# Altium project XMOS_TSBOARD.PrjPCB
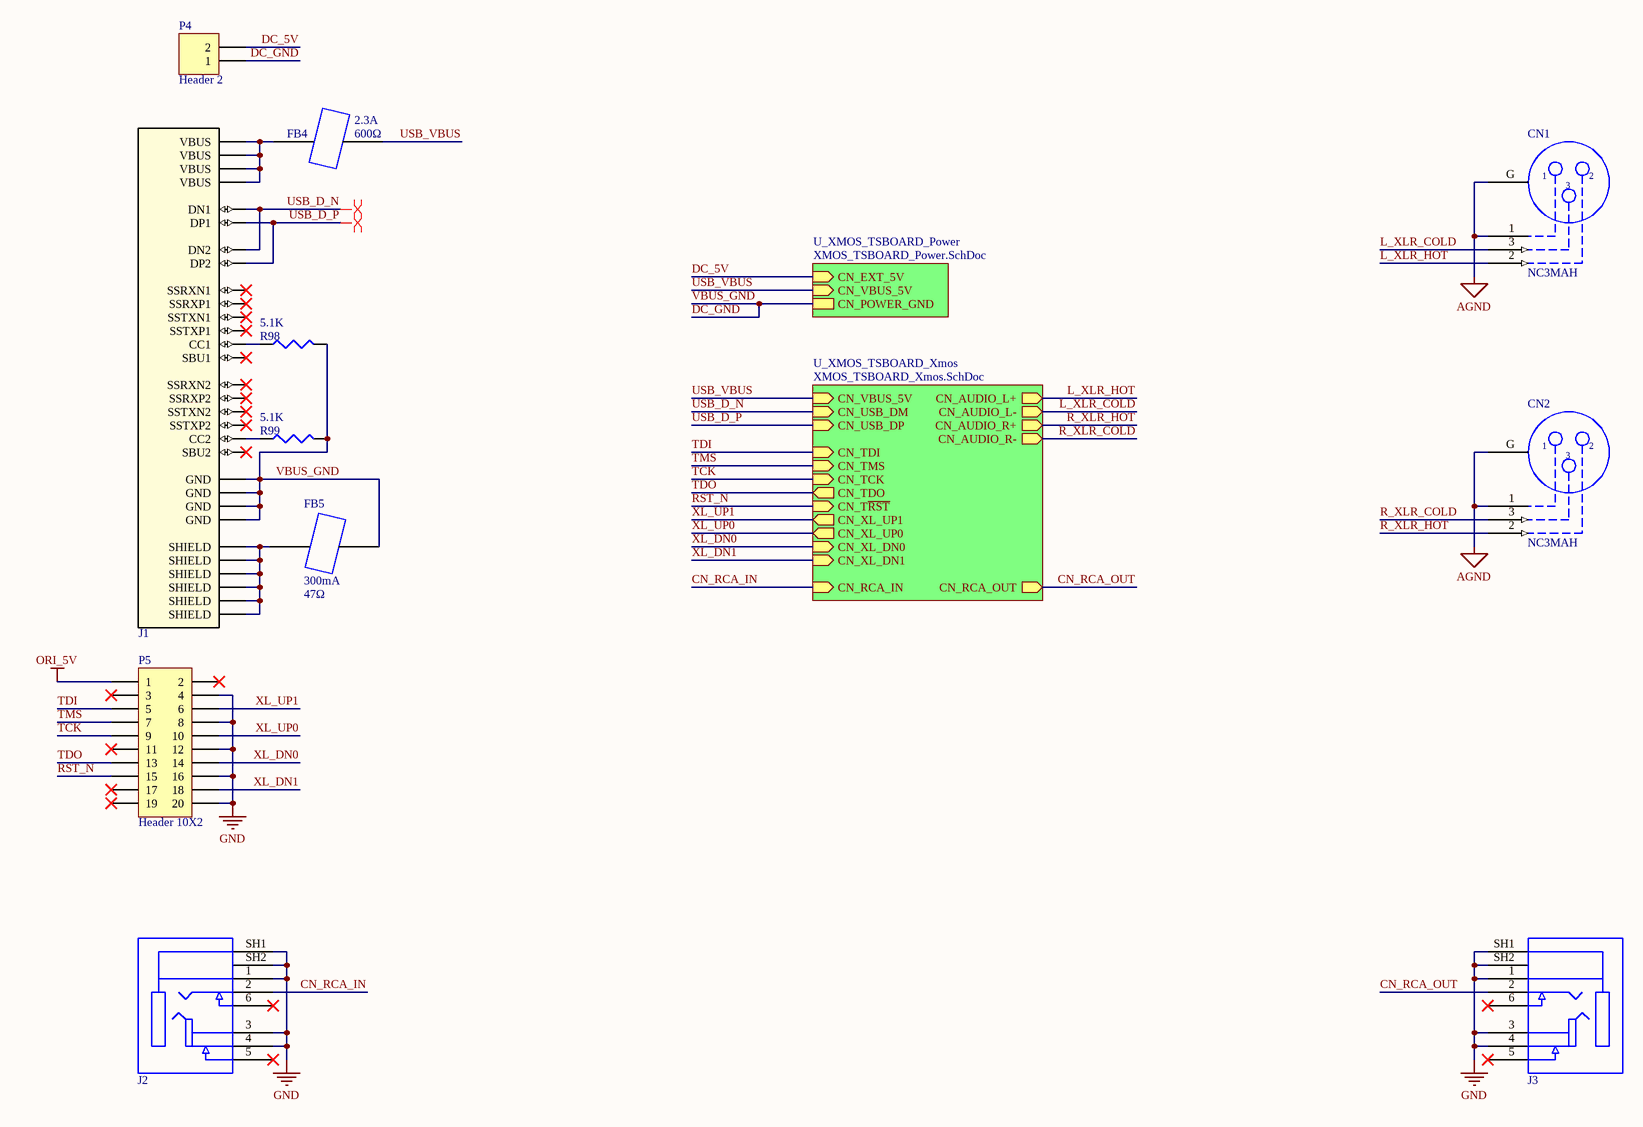
[diagram p0: XMOS_TSBOARD_Top.SchDoc]
8 sheets, 361 parts. Net scope: hierarchical (ports join the sheet entries above them; power ports are global).
Board file: XMOS_TSBOARD.PcbDoc
Sheets:
  XMOS_TSBOARD_Top.SchDoc
    U_XMOS_TSBOARD_Power = XMOS_TSBOARD_Power.SchDoc
    U_XMOS_TSBOARD_Xmos = XMOS_TSBOARD_Xmos.SchDoc
      U_XMOS_TSBOARD_PHY = XMOS_TSBOARD_PHY.SchDoc
      DACR = XMOS_TSBOARD_DAC.SchDoc
      LPFR = XMOS_TSBOARD_IV.SchDoc
      DACL = XMOS_TSBOARD_DAC.SchDoc
      LPFL = XMOS_TSBOARD_IV.SchDoc
      U_XMOS_TSBOARD_SPDIF = XMOS_TSBOARD_SPDIF.SchDoc
      U_XMOS_TSBOARD_Clock = XMOS_TSBOARD_Clock.SchDoc

## Sheet XMOS_TSBOARD_Top.SchDoc
size A3; DocumentNumber: 1; SheetNumber: 1; SheetTotal: 8

### Parts
CN1  NC3MAH  [NC3MAH]
CN2  NC3MAH  [NC3MAH]
FB4  RatedCurrent: 2.3A  Impedance(100MHz): 600Ω  [0805]  (hidden comment: FerriteBeads)
FB5  RatedCurrent: 300mA  Impedance(100MHz): 47Ω  [0603]  (hidden comment: FerriteBeads)
J1  UJ31-CH-G1-SMT-TR  [UJ31-CH-G1-SMT-TR]  (value not drawn)
J2  SJ-3506-SMT-TR  [SJ-3506-SMT-TR]  (value not drawn)
J3  SJ-3506-SMT-TR  [SJ-3506-SMT-TR]  (value not drawn)
P4  Header 2  [HDR1X2]
P5  Header 10X2  [HDR2X10]
R98  value 5.1K  [J1-0603]  (hidden comment: Res3)
R99  value 5.1K  [J1-0603]  (hidden comment: Res3)

### Sub-sheets
U_XMOS_TSBOARD_Power = XMOS_TSBOARD_Power.SchDoc: CN_EXT_5V (in), CN_VBUS_5V (in), CN_POWER_GND
U_XMOS_TSBOARD_Xmos = XMOS_TSBOARD_Xmos.SchDoc: CN_USB_DP (in), CN_USB_DM (in), CN_VBUS_5V (in), CN_TDO (out), CN_TDI (in), CN_TCK (in), CN_TMS (in), CN_T~{RST} (in), CN_AUDIO_L+ (out), CN_AUDIO_L- (out), CN_AUDIO_R+ (out), CN_AUDIO_R- (out), CN_RCA_IN (in), CN_RCA_OUT (out), CN_XL_DN0 (in), CN_XL_DN1 (in), CN_XL_UP0 (out), CN_XL_UP1 (out)

### Nets
AGND: CN1.1 CN1.G CN2.1 CN2.G
GND: J2.1(SLEEVE) J2.3(RING) J2.4(ISOLATED_RING) J2.SH1(SHIELDING) J2.SH2(SHIELDING) J3.1(SLEEVE) J3.3(RING) J3.4(ISOLATED_RING) J3.SH1(SHIELDING) J3.SH2(SHIELDING) P5.4 P5.8 P5.12 P5.16 P5.20
ORI_5V: P5.1
CN_RCA_IN: J2.2(TIP) ; sheet U_XMOS_TSBOARD_Xmos/CN_RCA_IN
CN_RCA_OUT: J3.2(TIP) ; sheet U_XMOS_TSBOARD_Xmos/CN_RCA_OUT
DC_5V: P4.2 ; sheet U_XMOS_TSBOARD_Power/CN_EXT_5V
DC_GND: FB5.1 J1.A1(GND) J1.A12(GND) J1.B1(GND) J1.B12(GND) P4.1 R98.2 R99.2 ; sheet U_XMOS_TSBOARD_Power/CN_POWER_GND  [also labelled VBUS_GND]
L_XLR_COLD: CN1.3 ; sheet U_XMOS_TSBOARD_Xmos/CN_AUDIO_L-
L_XLR_HOT: CN1.2 ; sheet U_XMOS_TSBOARD_Xmos/CN_AUDIO_L+
R_XLR_COLD: CN2.3 ; sheet U_XMOS_TSBOARD_Xmos/CN_AUDIO_R-  [project net OUT1]
R_XLR_HOT: CN2.2 ; sheet U_XMOS_TSBOARD_Xmos/CN_AUDIO_R+  [project net OUT0]
RST_N: P5.15 ; sheet U_XMOS_TSBOARD_Xmos/CN_T~{RST}
TCK: P5.9 ; sheet U_XMOS_TSBOARD_Xmos/CN_TCK
TDI: P5.5 ; sheet U_XMOS_TSBOARD_Xmos/CN_TDI
TDO: P5.13 ; sheet U_XMOS_TSBOARD_Xmos/CN_TDO
TMS: P5.7 ; sheet U_XMOS_TSBOARD_Xmos/CN_TMS
USB_D_N: J1.A7(DN1) J1.B7(DN2) ; sheet U_XMOS_TSBOARD_Xmos/CN_USB_DM
USB_D_P: J1.A6(DP1) J1.B6(DP2) ; sheet U_XMOS_TSBOARD_Xmos/CN_USB_DP
USB_VBUS: FB4.1 ; sheet U_XMOS_TSBOARD_Power/CN_VBUS_5V, sheet U_XMOS_TSBOARD_Xmos/CN_VBUS_5V
XL_DN0: P5.14 ; sheet U_XMOS_TSBOARD_Xmos/CN_XL_DN0
XL_DN1: P5.18 ; sheet U_XMOS_TSBOARD_Xmos/CN_XL_DN1
XL_UP0: P5.10 ; sheet U_XMOS_TSBOARD_Xmos/CN_XL_UP0
XL_UP1: P5.6 ; sheet U_XMOS_TSBOARD_Xmos/CN_XL_UP1
NetFB4_2: FB4.2 J1.A4(VBUS) J1.A9(VBUS) J1.B4(VBUS) J1.B9(VBUS)
NetFB5_2: FB5.2 J1.SH1(SHIELD) J1.SH2(SHIELD) J1.SH3(SHIELD) J1.SH4(SHIELD) J1.SH5(SHIELD) J1.SH6(SHIELD)
NetJ1_A5: J1.A5(CC1) R98.1
NetJ1_B5: J1.B5(CC2) R99.1

Not connected (* = marked no-connect by the designer): J1 A2(SSTXP1)* A3(SSTXN1)* A8(SBU1)* A10(SSRXN2)* A11(SSRXP2)* B2(SSTXP2)* B3(SSTXN2)* B8(SBU2)* B10(SSRXN1)* B11(SSRXP1)*; J2 5(ISOLATED_RING_SWITCH(N-O))* 6(TIP_SWITCH)*; J3 5(ISOLATED_RING_SWITCH(N-O))* 6(TIP_SWITCH)*; P5 2* 3* 11* 17* 19*

### Layout directives
differential pair: USB_D_N, USB_D_P

### Library data of the parts
CN1 CN2 = NC3MAH: 3 pole male XLR receptacle
FB4 = FerriteBeads: Chip Ferrite Beads; DCResistance: 0.06Ω; ManID: BLM21SP601
FB5 = FerriteBeads: Chip Ferrite Beads; DCResistance: 0.55Ω; ManID: BLM18BA470
J1 = UJ31-CH-G1-SMT-TR: USB Type C receptacle
J2 J3 = SJ-3506-SMT-TR: Mid Mount Audio Jack
P4 = Header 2: Header, 2-Pin; LatestRevisionDate: 17-Jul-2002; LatestRevisionNote: Re-released for DXP Platform.; Publisher: Altium Limited
P5 = Header 10X2: Header, 10-Pin, Dual row; LatestRevisionDate: 17-Jul-2002; LatestRevisionNote: Re-released for DXP Platform.; Publisher: Altium Limited
R98 R99 = Res3: Resistor; Published: 8-Jun-2000; LatestRevisionDate: 29-May-2009; LatestRevisionNote: IPC-7351 Footprint Added.; PackageReference: J1-0603; Publisher: Altium Limited; PackageDescription: Chip Resistor

## Sheet XMOS_TSBOARD_Power.SchDoc
size A3; DocumentNumber: 2; SheetNumber: 2; SheetTotal: 8
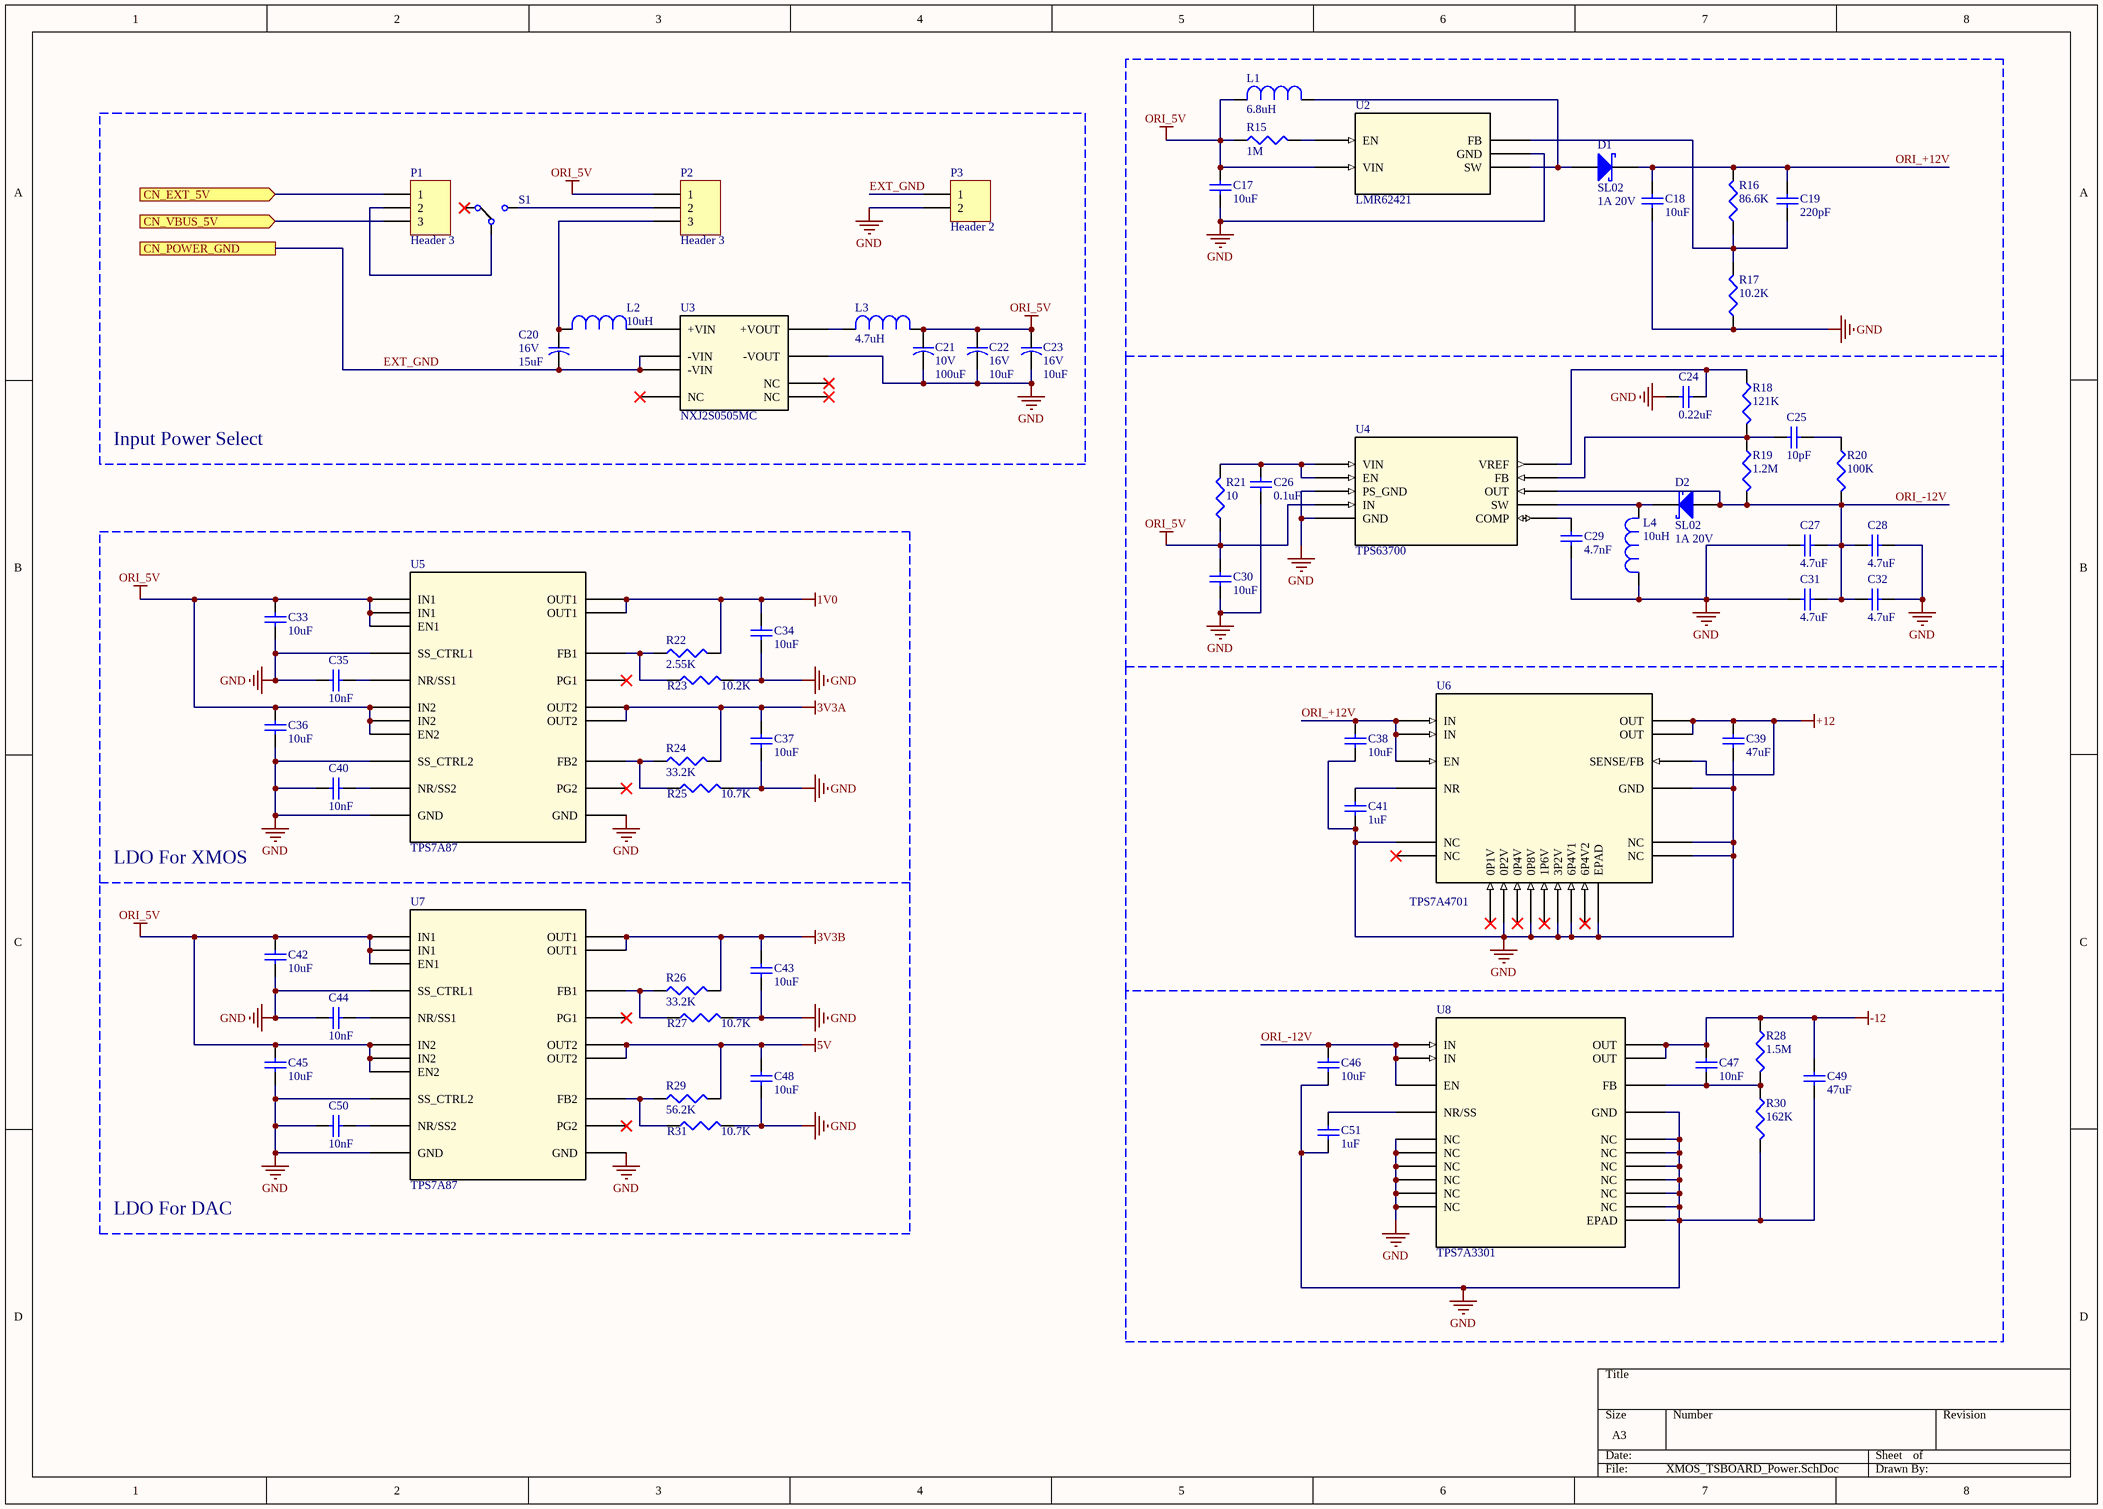
[diagram p1: XMOS_TSBOARD_Power.SchDoc]

### Parts
C17  value 10uF  [1608[0603]]  (hidden comment: Cap Semi)
C18  value 10uF  [C0805]  (hidden comment: Cap Semi)
C19  value 220pF  [1608[0603]]  (hidden comment: Cap Semi)
C20  value 15uF  RatedVoltage: 16V  [3528-21]  (hidden comment: KO-CAP)
C21  value 100uF  RatedVoltage: 10V  [3528-21]  (hidden comment: KO-CAP)
C22  value 10uF  RatedVoltage: 16V  [3528-21]  (hidden comment: KO-CAP)
C23  value 10uF  RatedVoltage: 16V  [3528-21]  (hidden comment: KO-CAP)
C24  value 0.22uF  [1608[0603]]  (hidden comment: Cap Semi)
C25  value 10pF  [1608[0603]]  (hidden comment: Cap Semi)
C26  value 0.1uF  [1608[0603]]  (hidden comment: Cap Semi)
C27  value 4.7uF  [C0805]  (hidden comment: Cap Semi)
C28  value 4.7uF  [C0805]  (hidden comment: Cap Semi)
C29  value 4.7nF  [1608[0603]]  (hidden comment: Cap Semi)
C30  value 10uF  [1608[0603]]  (hidden comment: Cap Semi)
C31  value 4.7uF  [C0805]  (hidden comment: Cap Semi)
C32  value 4.7uF  [C0805]  (hidden comment: Cap Semi)
C33  value 10uF  [1608[0603]]  (hidden comment: Cap Semi)
C34  value 10uF  [1608[0603]]  (hidden comment: Cap Semi)
C35  value 10nF  [1608[0603]]  (hidden comment: Cap Semi)
C36  value 10uF  [1608[0603]]  (hidden comment: Cap Semi)
C37  value 10uF  [1608[0603]]  (hidden comment: Cap Semi)
C38  value 10uF  [C0805]  (hidden comment: Cap Semi)
C39  value 47uF  [C1210]  (hidden comment: Cap Semi)
C40  value 10nF  [1608[0603]]  (hidden comment: Cap Semi)
C41  value 1uF  [1608[0603]]  (hidden comment: Cap Semi)
C42  value 10uF  [1608[0603]]  (hidden comment: Cap Semi)
C43  value 10uF  [1608[0603]]  (hidden comment: Cap Semi)
C44  value 10nF  [1608[0603]]  (hidden comment: Cap Semi)
C45  value 10uF  [1608[0603]]  (hidden comment: Cap Semi)
C46  value 10uF  [C0805]  (hidden comment: Cap Semi)
C47  value 10nF  [1608[0603]]  (hidden comment: Cap Semi)
C48  value 10uF  [1608[0603]]  (hidden comment: Cap Semi)
C49  value 47uF  [C1210]  (hidden comment: Cap Semi)
C50  value 10nF  [1608[0603]]  (hidden comment: Cap Semi)
C51  value 1uF  [1608[0603]]  (hidden comment: Cap Semi)
D1  SL02  value 1A 20V  [DO-219AB]
D2  SL02  value 1A 20V  [DO-219AB]
L1  value 6.8uH  [4240]  (hidden comment: SPM)
L2  value 10uH  [5250]  (hidden comment: SPM)
L3  value 4.7uH  [4240]  (hidden comment: SPM)
L4  value 10uH  [4240]  (hidden comment: SPM)
P1  Header 3  [HDR1X3]
P2  Header 3  [HDR1X3]
P3  Header 2  [HDR1X2]
R15  value 1M  [J1-0603]  (hidden comment: Res3)
R16  value 86.6K  [J1-0603]  (hidden comment: Res3)
R17  value 10.2K  [J1-0603]  (hidden comment: Res3)
R18  value 121K  [J1-0603]  (hidden comment: Res3)
R19  value 1.2M  [J1-0603]  (hidden comment: Res3)
R20  value 100K  [J1-0603]  (hidden comment: Res3)
R21  value 10  [J1-0603]  (hidden comment: Res3)
R22  value 2.55K  [J1-0603]  (hidden comment: Res3)
R23  value 10.2K  [J1-0603]  (hidden comment: Res3)
R24  value 33.2K  [J1-0603]  (hidden comment: Res3)
R25  value 10.7K  [J1-0603]  (hidden comment: Res3)
R26  value 33.2K  [J1-0603]  (hidden comment: Res3)
R27  value 10.7K  [J1-0603]  (hidden comment: Res3)
R28  value 1.5M  [J1-0603]  (hidden comment: Res3)
R29  value 56.2K  [J1-0603]  (hidden comment: Res3)
R30  value 162K  [J1-0603]  (hidden comment: Res3)
R31  value 10.7K  [J1-0603]  (hidden comment: Res3)
S1  SSSS213202  [SS_SMD_213202]  (value not drawn)
U2  LMR62421  [DBV5]
U3  NXJ2S0505MC  [SMD_NXJ2S0505]
U4  TPS63700  [DRC10]
U5  TPS7A87  [RTJ20]
U6  TPS7A4701  [RGW20]
U7  TPS7A87  [RTJ20]
U8  TPS7A3301  [RGW20]

### Blocks framed on the sheet
Input Power Select: C20-C23 L2 L3 P1-P3 S1 U3
LDO For XMOS: C33-C37 C40 R22-R25 U5
LDO For DAC: C42-C45 C48 C50 R26 R27 R29 R31 U7

### Ports
CN_EXT_5V (in), CN_POWER_GND, CN_VBUS_5V (in)

### Nets
1V0: C34.2 R22.2 U5.14(OUT1) U5.15(OUT1)
3V3A: C37.2 R24.2 U5.11(OUT2) U5.12(OUT2)
3V3B: C43.2 R26.2 U7.14(OUT1) U7.15(OUT1)
5V: C48.2 R29.2 U7.11(OUT2) U7.12(OUT2)
+12: C39.2 U6.1(OUT) U6.3(SENSE/FB) U6.20(OUT)
-12: C47.1 C49.2 R28.1 U8.1(OUT) U8.20(OUT)
GND: C17.1 C18.1 C21.2 C22.2 C23.2 C24.2 C26.1 C27.2 C28.1 C29.2 C30.1 C31.2 C32.1 C33.1 C34.1 C35.1 C36.1 C37.1 C38.1 C39.1 C40.1 C41.1 C42.1 C43.1 C44.1 C45.1 C46.1 C48.1 C49.1 C50.1 C51.1 L4.2 P3.2 R17.1 R23.2 R25.2 R27.2 R30.2 R31.2 U2.2(GND) U3.5(-VOUT) U4.2(GND) U4.7(PS_GND) U5.3(GND) U5.8(SS_CTRL2) U5.13(GND) U5.18(SS_CTRL1) U6.5(6P4V1) U6.6(3P2V) U6.7(GND) U6.9(0P8V) U6.11(0P2V) U6.17(NC) U6.18(NC) U6.19(NC) U6.21(EPAD) U7.3(GND) U7.8(SS_CTRL2) U7.13(GND) U7.18(SS_CTRL1) U8.2(NC) U8.4(NC) U8.5(NC) U8.6(NC) U8.7(GND) U8.8(NC) U8.9(NC) U8.10(NC) U8.11(NC) U8.12(NC) U8.17(NC) U8.18(NC) U8.19(NC) U8.21(EPAD)
ORI_5V: C17.2 C21.1 C22.1 C23.1 C30.2 C33.2 C36.2 C42.2 C45.2 L1.2 L3.1 P2.1 R15.1 R21.1 U2.5(VIN) U4.5(IN) U5.1(IN1) U5.2(IN1) U5.4(IN2) U5.5(IN2) U5.6(EN2) U5.20(EN1) U7.1(IN1) U7.2(IN1) U7.4(IN2) U7.5(IN2) U7.6(EN2) U7.20(EN1)
DC_5V: P1.1 ; port CN_EXT_5V
EXT_GND: C20.2 P3.1 U3.2(-VIN) U3.11(-VIN) ; port CN_POWER_GND  [project net DC_GND]
ORI_+12V: C18.2 C19.2 C38.2 D1.2 R16.2 U6.13(EN) U6.15(IN) U6.16(IN)
ORI_-12V: C27.1 C28.2 C31.1 C32.2 C46.2 D2.1 R19.2 R20.2 U4.8(OUT) U8.13(EN) U8.15(IN) U8.16(IN)
USB_VBUS: P1.3 ; port CN_VBUS_5V
NetC19_1: C19.1 R16.1 R17.2 U2.3(FB)
NetC20_1: C20.1 L2.2 P2.3
NetC24_1: C24.1 R18.1 U4.10(VREF)
NetC25_1: C25.1 R20.1
NetC25_2: C25.2 R18.2 R19.1 U4.9(FB)
NetC26_2: C26.2 R21.2 U4.3(VIN) U4.4(EN)
NetC29_1: C29.1 U4.1(COMP)
NetC35_2: C35.2 U5.19(NR/SS1)
NetC40_2: C40.2 U5.7(NR/SS2)
NetC41_2: C41.2 U6.14(NR)
NetC44_2: C44.2 U7.19(NR/SS1)
NetC47_2: C47.2 R28.2 R30.1 U8.3(FB)
NetC50_2: C50.2 U7.7(NR/SS2)
NetC51_2: C51.2 U8.14(NR/SS)
NetD1_1: D1.1 L1.1 U2.1(SW)
NetD2_2: D2.2 L4.1 U4.6(SW)
NetL2_1: L2.1 U3.1(+VIN)
NetL3_2: L3.2 U3.6(+VOUT)
NetP1_2: P1.2 S1.2(COM)
NetP2_2: P2.2 S1.3
NetR15_2: R15.2 U2.4(EN)
NetR22_1: R22.1 R23.1 U5.16(FB1)
NetR24_1: R24.1 R25.1 U5.10(FB2)
NetR26_1: R26.1 R27.1 U7.16(FB1)
NetR29_1: R29.1 R31.1 U7.10(FB2)

Not connected (* = marked no-connect by the designer): S1 1*; U3 7(NC)* 8(NC)* 12(NC)*; U5 9(PG2)* 17(PG1)*; U6 2(NC)* 4(6P4V2)* 8(1P6V)* 10(0P4V)* 12(0P1V)*; U7 9(PG2)* 17(PG1)*

### Library data of the parts
C17-C19 C24-C51 = Cap Semi: Capacitor (Semiconductor SIM Model); Published: 8-Jun-2000; LatestRevisionDate: 29-May-2009; LatestRevisionNote: IPC-7351 Footprint Added.; PackageReference: C1206; Publisher: Altium Limited; PackageDescription: Chip Capacitor
C20-C23 = T520B: Polymer Electrolytic Capacitors
D1 D2 = SL02: Schottky Rectifier
L1 = SPM: Inductors for power circuits, wound metal, SPM series; ManCode: SPM5030-HZ
L2 L3 = SPM: Inductors for power circuits, wound metal, SPM series
L4 = SPM: Inductors for power circuits, wound metal, SPM series; List: SPM5030-HZ
P1 P2 = Header 3: Header, 3-Pin; LatestRevisionDate: 17-Jul-2002; LatestRevisionNote: Re-released for DXP Platform.; Publisher: Altium Limited
P3 = Header 2: Header, 2-Pin; LatestRevisionDate: 17-Jul-2002; LatestRevisionNote: Re-released for DXP Platform.; Publisher: Altium Limited
R15-R31 = Res3: Resistor; Published: 8-Jun-2000; LatestRevisionDate: 29-May-2009; LatestRevisionNote: IPC-7351 Footprint Added.; PackageReference: J1-0603; Publisher: Altium Limited; PackageDescription: Chip Resistor
S1 = SSSS213202: Slide Switch 3.5(H)mm, 2.0mm-travel Type SSSS2 Series
U2 = LMR62421: LMR62421 SIMPLE SWITCHER® 24Vout, 2.1A Step-Up Voltage Regulator in SOT-23
U3 = NXJ2S0505MC: Isolated 2W Single Output SM DC-DC Converters
U4 = TPS63700: DC-DC Inverter
U5 U7 = TPS7A87: Dual, 500-mA, Low-Noise (3.8 μVRMS), LDO Voltage Regulator
U6 = TPS7A4701: TPS7A470x 36-V, 1-A, 4-µVRMS, RF LDO Voltage Regulator
U8 = TPS7A3301: TPS7A33 –36-V, 1-A, Ultralow-Noise Negative Voltage Regulator

## Sheet XMOS_TSBOARD_Xmos.SchDoc
size A3; DocumentNumber: 3; SheetNumber: 3; SheetTotal: 8
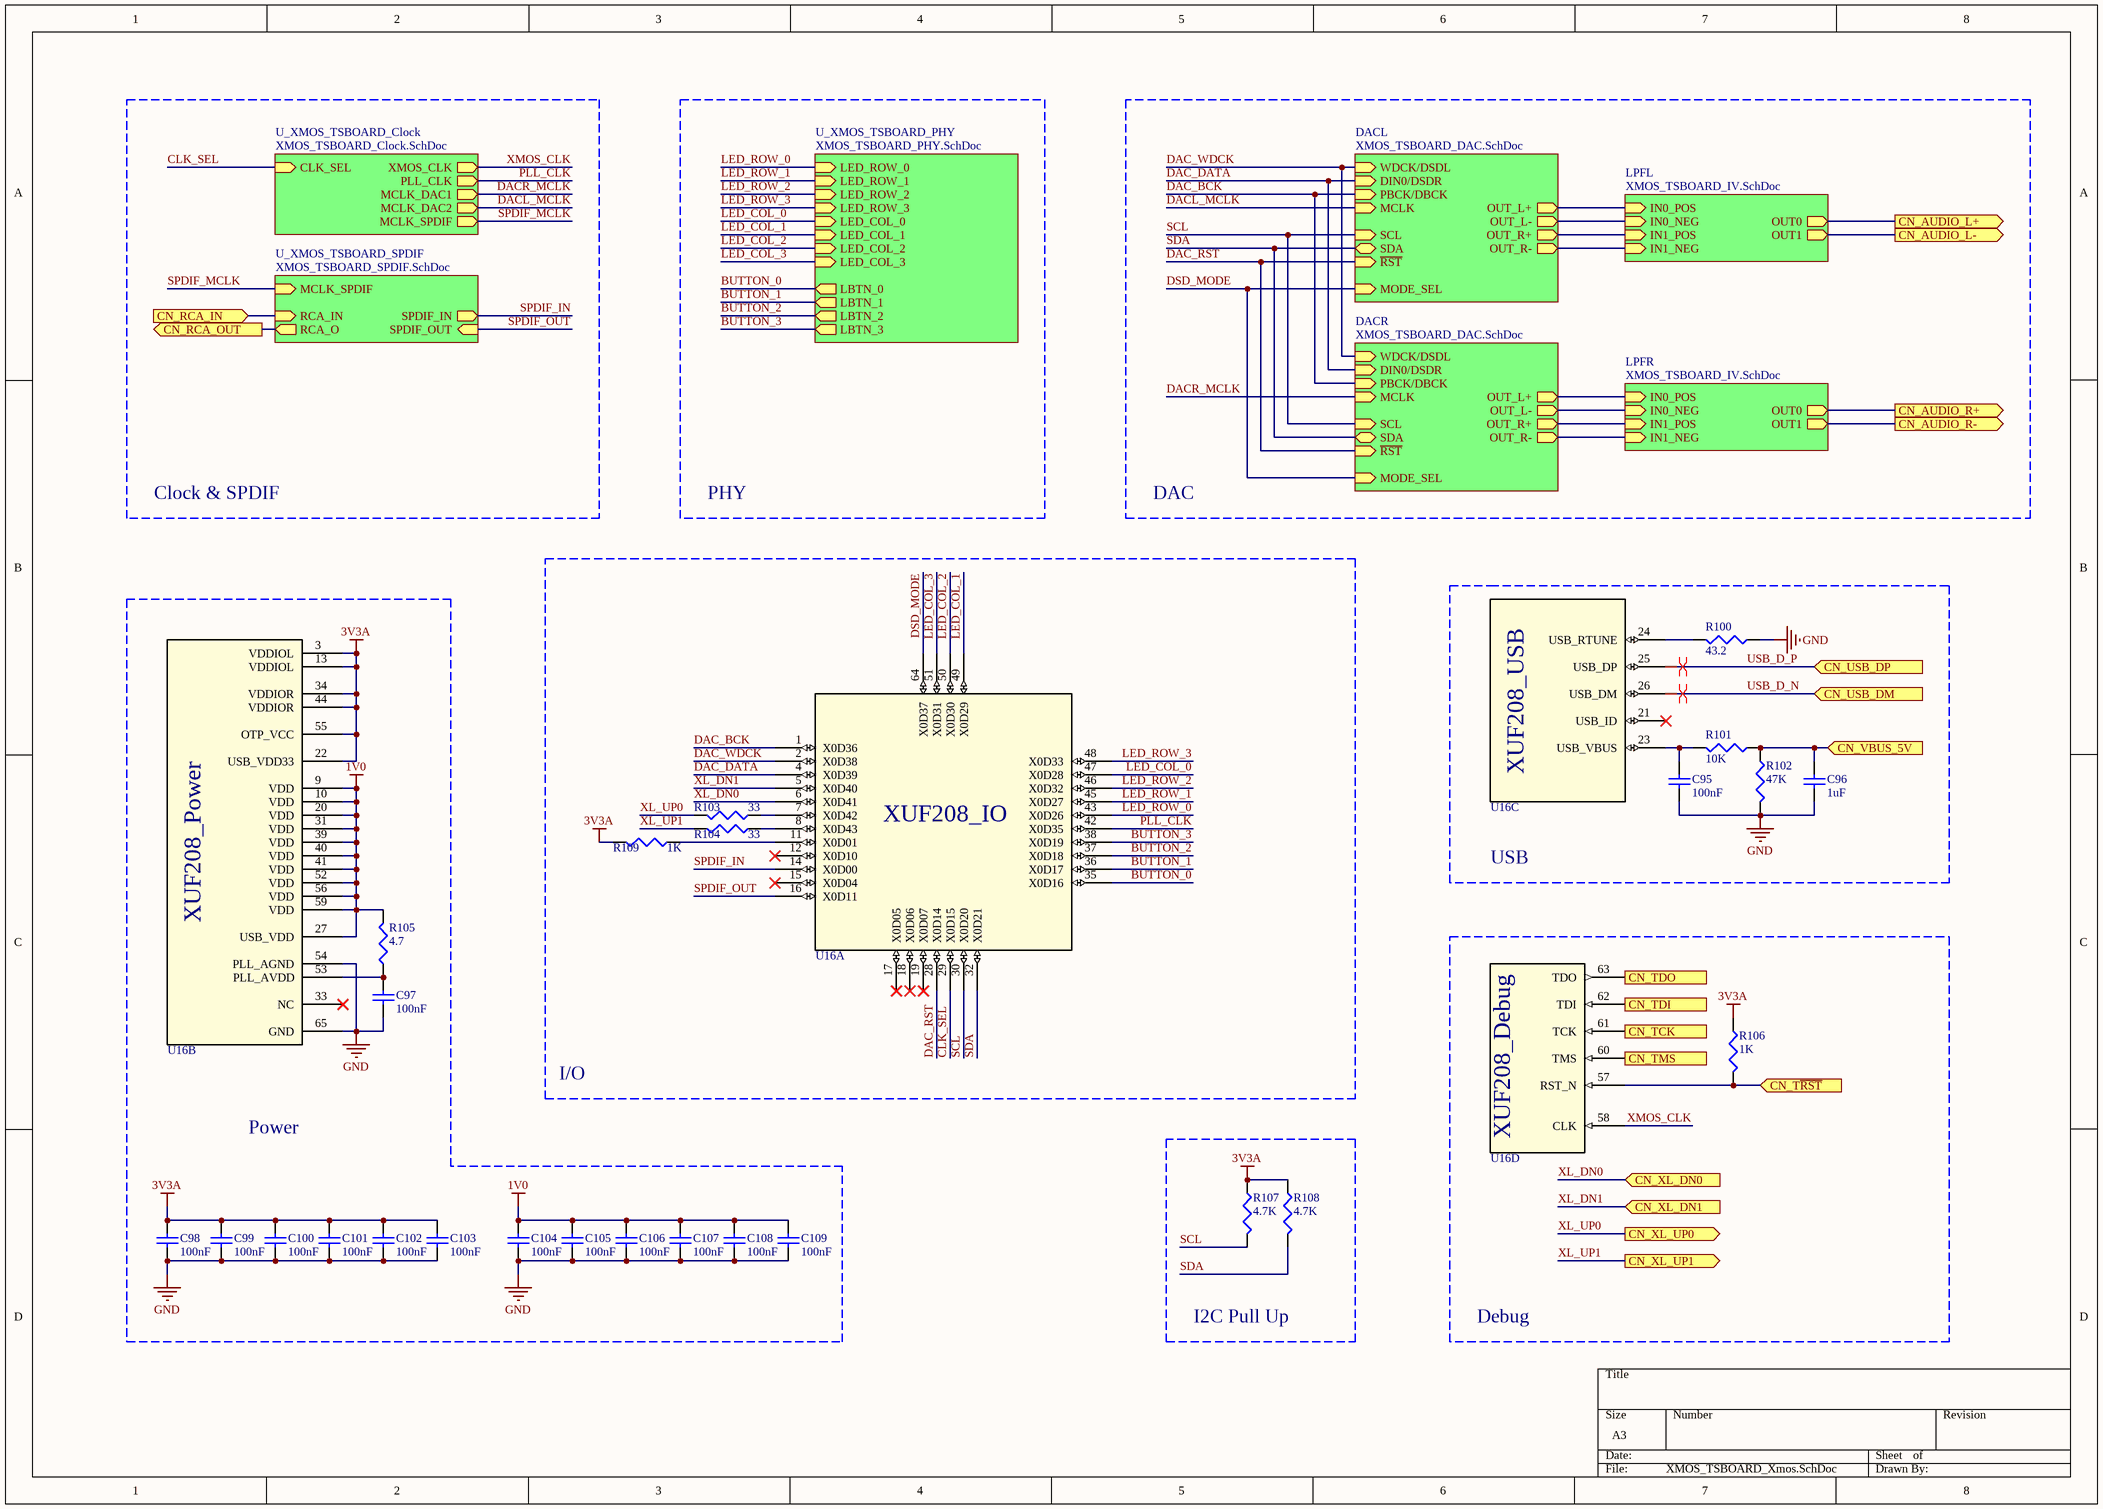
[diagram p2: XMOS_TSBOARD_Xmos.SchDoc]

### Parts
C95  value 100nF  [1608[0603]]  (hidden comment: Cap Semi)
C96  value 1uF  [1608[0603]]  (hidden comment: Cap Semi)
C97  value 100nF  [1608[0603]]  (hidden comment: Cap Semi)
C98  value 100nF  [1608[0603]]  (hidden comment: Cap Semi)
C99  value 100nF  [1608[0603]]  (hidden comment: Cap Semi)
C100  value 100nF  [1608[0603]]  (hidden comment: Cap Semi)
C101  value 100nF  [1608[0603]]  (hidden comment: Cap Semi)
C102  value 100nF  [1608[0603]]  (hidden comment: Cap Semi)
C103  value 100nF  [1608[0603]]  (hidden comment: Cap Semi)
C104  value 100nF  [1608[0603]]  (hidden comment: Cap Semi)
C105  value 100nF  [1608[0603]]  (hidden comment: Cap Semi)
C106  value 100nF  [1608[0603]]  (hidden comment: Cap Semi)
C107  value 100nF  [1608[0603]]  (hidden comment: Cap Semi)
C108  value 100nF  [1608[0603]]  (hidden comment: Cap Semi)
C109  value 100nF  [1608[0603]]  (hidden comment: Cap Semi)
R100  value 43.2  [J1-0603]  (hidden comment: Res3)
R101  value 10K  [J1-0603]  (hidden comment: Res3)
R102  value 47K  [J1-0603]  (hidden comment: Res3)
R103  value 33  [J1-0603]  (hidden comment: Res3)
R104  value 33  [J1-0603]  (hidden comment: Res3)
R105  value 4.7  [J1-0603]  (hidden comment: Res3)
R106  value 1K  [J1-0603]  (hidden comment: Res3)
R107  value 4.7K  [J1-0603]  (hidden comment: Res3)
R108  value 4.7K  [J1-0603]  (hidden comment: Res3)
R109  value 1K  [J1-0603]  (hidden comment: Res3)
U16  XUF208-256-TQ64  [TQFP64]  (value not drawn)  (parts A,B,C,D of 4)

### Blocks framed on the sheet
I/O: R103 R104 R109 U16
Power: C97-C109 R105 U16
USB: C95 C96 R100-R102 U16
Debug: R106 U16
I2C Pull Up: R107 R108

### Sub-sheets
DACL = XMOS_TSBOARD_DAC.SchDoc: MODE_SEL (in), MCLK (in), SCL (in), SDA (bidir), ~{RST} (in), WDCK/DSDL (in), PBCK/DBCK (in), DIN0/DSDR (in), OUT_L- (out), OUT_L+ (out), OUT_R- (out), OUT_R+ (out)
DACR = XMOS_TSBOARD_DAC.SchDoc: MODE_SEL (in), MCLK (in), SCL (in), SDA (bidir), ~{RST} (in), WDCK/DSDL (in), PBCK/DBCK (in), DIN0/DSDR (in), OUT_L- (out), OUT_L+ (out), OUT_R- (out), OUT_R+ (out)
LPFL = XMOS_TSBOARD_IV.SchDoc: IN0_POS (in), IN0_NEG (in), IN1_POS (in), IN1_NEG (in), OUT0 (out), OUT1 (out)
LPFR = XMOS_TSBOARD_IV.SchDoc: IN0_POS (in), IN0_NEG (in), IN1_POS (in), IN1_NEG (in), OUT0 (out), OUT1 (out)
U_XMOS_TSBOARD_Clock = XMOS_TSBOARD_Clock.SchDoc: CLK_SEL (in), XMOS_CLK (out), PLL_CLK (out), MCLK_DAC1 (out), MCLK_DAC2 (out), MCLK_SPDIF (out)
U_XMOS_TSBOARD_PHY = XMOS_TSBOARD_PHY.SchDoc: LED_ROW_0 (in), LED_ROW_1 (in), LED_ROW_2 (in), LED_ROW_3 (in), LED_COL_0 (in), LED_COL_1 (in), LED_COL_2 (in), LED_COL_3 (in), LBTN_0 (out), LBTN_1 (out), LBTN_2 (out), LBTN_3 (out)
U_XMOS_TSBOARD_SPDIF = XMOS_TSBOARD_SPDIF.SchDoc: SPDIF_OUT (in), MCLK_SPDIF (in), RCA_IN (in), RCA_O (out), SPDIF_IN (out)

### Ports
CN_AUDIO_L+ (out), CN_AUDIO_L- (out), CN_AUDIO_R+ (out), CN_AUDIO_R- (out), CN_RCA_IN (in), CN_RCA_OUT (out), CN_TCK (in), CN_TDI (in), CN_TDO (out), CN_TMS (in), CN_T~{RST} (in), CN_USB_DM (in), CN_USB_DP (in), CN_VBUS_5V (in), CN_XL_DN0 (in), CN_XL_DN1 (in), CN_XL_UP0 (out), CN_XL_UP1 (out)

### Nets
1V0: C104.2 C105.2 C106.2 C107.2 C108.2 C109.2 R105.2 U16.9(VDD) U16.10(VDD) U16.20(VDD) U16.27(USB_VDD) U16.31(VDD) U16.39(VDD) U16.40(VDD) U16.41(VDD) U16.52(VDD) U16.56(VDD) U16.59(VDD)
3V3A: C98.2 C99.2 C100.2 C101.2 C102.2 C103.2 R106.1 R107.1 R108.1 R109.2 U16.3(VDDIOL) U16.13(VDDIOL) U16.22(USB_VDD33) U16.34(VDDIOR) U16.44(VDDIOR) U16.55(OTP_VCC)
GND: C95.1 C96.1 C97.1 C98.1 C99.1 C100.1 C101.1 C102.1 C103.1 C104.1 C105.1 C106.1 C107.1 C108.1 C109.1 R100.1 R102.2 U16.54(PLL_AGND) U16.65(GND)
BUTTON_0: U16.35(X0D16) ; sheet U_XMOS_TSBOARD_PHY/LBTN_0
BUTTON_1: U16.36(X0D17) ; sheet U_XMOS_TSBOARD_PHY/LBTN_1
BUTTON_2: U16.37(X0D18) ; sheet U_XMOS_TSBOARD_PHY/LBTN_2
BUTTON_3: U16.38(X0D19) ; sheet U_XMOS_TSBOARD_PHY/LBTN_3
CLK_SEL: U16.29(X0D15) ; sheet U_XMOS_TSBOARD_Clock/CLK_SEL
CN_RCA_IN: port CN_RCA_IN, sheet U_XMOS_TSBOARD_SPDIF/RCA_IN
CN_RCA_OUT: port CN_RCA_OUT, sheet U_XMOS_TSBOARD_SPDIF/RCA_O
DAC_BCK: U16.1(X0D36) ; sheet DACR/PBCK/DBCK, sheet DACL/PBCK/DBCK
DAC_DATA: U16.4(X0D39) ; sheet DACR/DIN0/DSDR, sheet DACL/DIN0/DSDR
DAC_RST: U16.28(X0D14) ; sheet DACR/~{RST}, sheet DACL/~{RST}
DAC_WDCK: U16.2(X0D38) ; sheet DACR/WDCK/DSDL, sheet DACL/WDCK/DSDL
DACL_MCLK: sheet DACL/MCLK, sheet U_XMOS_TSBOARD_Clock/MCLK_DAC2
DACR_MCLK: sheet DACR/MCLK, sheet U_XMOS_TSBOARD_Clock/MCLK_DAC1
DSD_MODE: U16.64(X0D37) ; sheet DACR/MODE_SEL, sheet DACL/MODE_SEL
IN0_N: sheet DACR/OUT_L-, sheet LPFR/IN0_NEG
IN0_N: sheet DACL/OUT_L-, sheet LPFL/IN0_NEG  [a separate net that carries the same name]
IN0_P: sheet DACR/OUT_L+, sheet LPFR/IN0_POS
IN0_P: sheet DACL/OUT_L+, sheet LPFL/IN0_POS  [a separate net that carries the same name]
IN1_N: sheet DACR/OUT_R-, sheet LPFR/IN1_NEG
IN1_N: sheet DACL/OUT_R-, sheet LPFL/IN1_NEG  [a separate net that carries the same name]
IN1_P: sheet DACR/OUT_R+, sheet LPFR/IN1_POS
IN1_P: sheet DACL/OUT_R+, sheet LPFL/IN1_POS  [a separate net that carries the same name]
L_XLR_COLD: port CN_AUDIO_L-, sheet LPFL/OUT1
L_XLR_HOT: port CN_AUDIO_L+, sheet LPFL/OUT0
LED_COL_0: U16.47(X0D28) ; sheet U_XMOS_TSBOARD_PHY/LED_COL_0
LED_COL_1: U16.49(X0D29) ; sheet U_XMOS_TSBOARD_PHY/LED_COL_1
LED_COL_2: U16.50(X0D30) ; sheet U_XMOS_TSBOARD_PHY/LED_COL_2
LED_COL_3: U16.51(X0D31) ; sheet U_XMOS_TSBOARD_PHY/LED_COL_3
LED_ROW_0: U16.43(X0D26) ; sheet U_XMOS_TSBOARD_PHY/LED_ROW_0
LED_ROW_1: U16.45(X0D27) ; sheet U_XMOS_TSBOARD_PHY/LED_ROW_1
LED_ROW_2: U16.46(X0D32) ; sheet U_XMOS_TSBOARD_PHY/LED_ROW_2
LED_ROW_3: U16.48(X0D33) ; sheet U_XMOS_TSBOARD_PHY/LED_ROW_3
OUT0: port CN_AUDIO_R+, sheet LPFR/OUT0
OUT1: port CN_AUDIO_R-, sheet LPFR/OUT1
PLL_CLK: U16.42(X0D35) ; sheet U_XMOS_TSBOARD_Clock/PLL_CLK
RST_N: R106.2 U16.57(RST_N) ; port CN_T~{RST}
SCL: R107.2 U16.30(X0D20) ; sheet DACR/SCL, sheet DACL/SCL
SDA: R108.2 U16.32(X0D21) ; sheet DACR/SDA, sheet DACL/SDA
SPDIF_IN: U16.14(X0D00) ; sheet U_XMOS_TSBOARD_SPDIF/SPDIF_IN
SPDIF_MCLK: sheet U_XMOS_TSBOARD_SPDIF/MCLK_SPDIF, sheet U_XMOS_TSBOARD_Clock/MCLK_SPDIF
SPDIF_OUT: U16.16(X0D11) ; sheet U_XMOS_TSBOARD_SPDIF/SPDIF_OUT
TCK: U16.61(TCK) ; port CN_TCK
TDI: U16.62(TDI) ; port CN_TDI
TDO: U16.63(TDO) ; port CN_TDO
TMS: U16.60(TMS) ; port CN_TMS
USB_D_N: U16.26(USB_DM) ; port CN_USB_DM
USB_D_P: U16.25(USB_DP) ; port CN_USB_DP
USB_VBUS: C96.2 R101.1 R102.1 ; port CN_VBUS_5V
XL_DN0: U16.6(X0D41) ; port CN_XL_DN0
XL_DN1: U16.5(X0D40) ; port CN_XL_DN1
XL_UP0: R103.2 ; port CN_XL_UP0
XL_UP1: R104.2 ; port CN_XL_UP1
XMOS_CLK: U16.58(CLK) ; sheet U_XMOS_TSBOARD_Clock/XMOS_CLK
NetC95_2: C95.2 R101.2 U16.23(USB_VBUS)
NetC97_2: C97.2 R105.1 U16.53(PLL_AVDD)
NetR100_2: R100.2 U16.24(USB_RTUNE)
NetR103_1: R103.1 U16.7(X0D42)
NetR104_1: R104.1 U16.8(X0D43)
NetR109_1: R109.1 U16.11(X0D01)

Not connected (* = marked no-connect by the designer): U16 12(X0D10)* 15(X0D04)* 17(X0D05)* 18(X0D06)* 19(X0D07)* 21(USB_ID)* 33(NC)*

### Layout directives
differential pair: USB_D_N, USB_D_P

### Notes on the sheet
- Clock & SPDIF
- PHY
- DAC
- (in symbol XUF208-256-TQ64, part A) XUF208_IO
- (in symbol XUF208-256-TQ64, part B) XUF208_Power
- (in symbol XUF208-256-TQ64, part C) XUF208_USB
- (in symbol XUF208-256-TQ64, part D) XUF208_Debug

### Library data of the parts
C95-C109 = Cap Semi: Capacitor (Semiconductor SIM Model); Published: 8-Jun-2000; LatestRevisionDate: 29-May-2009; LatestRevisionNote: IPC-7351 Footprint Added.; PackageReference: C1206; Publisher: Altium Limited; PackageDescription: Chip Capacitor
R100-R109 = Res3: Resistor; Published: 8-Jun-2000; LatestRevisionDate: 29-May-2009; LatestRevisionNote: IPC-7351 Footprint Added.; PackageReference: J1-0603; Publisher: Altium Limited; PackageDescription: Chip Resistor
U16 = XUF208-256-TQ64: xCORE Multicore Microcontrollers

## Sheet XMOS_TSBOARD_PHY.SchDoc
size A3; DocumentNumber: 5; SheetNumber: 5; SheetTotal: 8
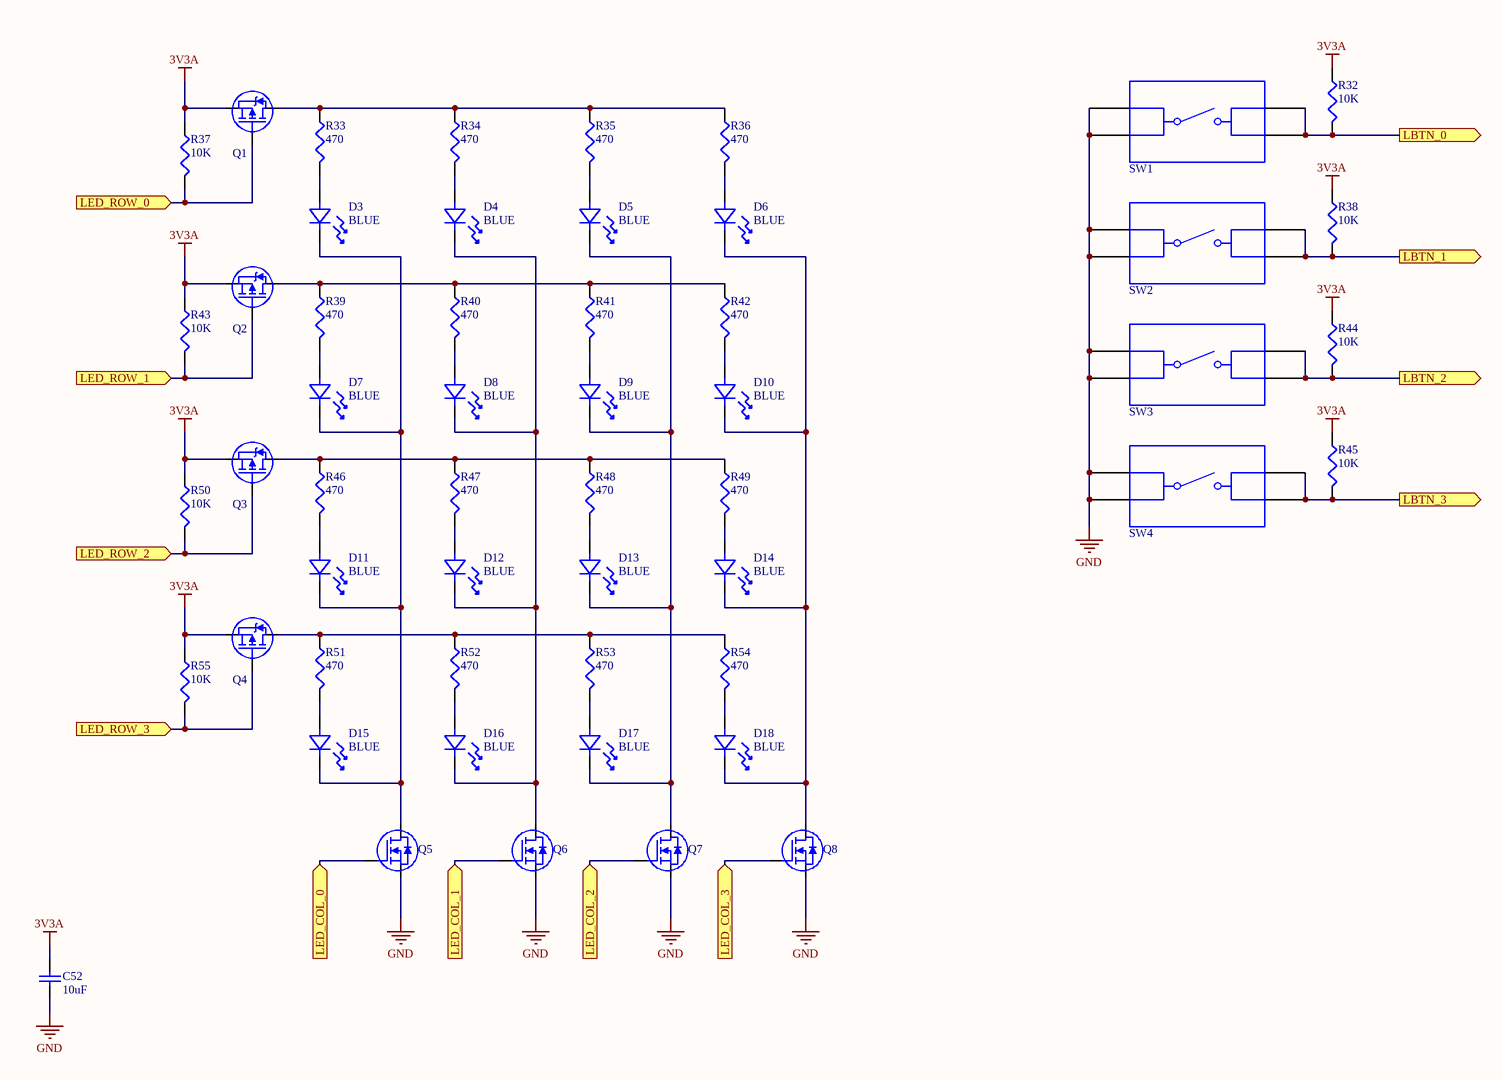
[diagram p3: XMOS_TSBOARD_PHY.SchDoc]

### Parts
C52  value 10uF  [1608[0603]]  (hidden comment: Cap Semi)
D3  BLUE  [0603_LED]
D4  BLUE  [0603_LED]
D5  BLUE  [0603_LED]
D6  BLUE  [0603_LED]
D7  BLUE  [0603_LED]
D8  BLUE  [0603_LED]
D9  BLUE  [0603_LED]
D10  BLUE  [0603_LED]
D11  BLUE  [0603_LED]
D12  BLUE  [0603_LED]
D13  BLUE  [0603_LED]
D14  BLUE  [0603_LED]
D15  BLUE  [0603_LED]
D16  BLUE  [0603_LED]
D17  BLUE  [0603_LED]
D18  BLUE  [0603_LED]
Q1  MOSFET  [SOT-23]  (value not drawn)
Q2  MOSFET  [SOT-23]  (value not drawn)
Q3  MOSFET  [SOT-23]  (value not drawn)
Q4  MOSFET  [SOT-23]  (value not drawn)
Q5  BSS138  [SOT-23]  (value not drawn)
Q6  BSS138  [SOT-23]  (value not drawn)
Q7  BSS138  [SOT-23]  (value not drawn)
Q8  BSS138  [SOT-23]  (value not drawn)
R32  value 10K  [J1-0603]  (hidden comment: Res3)
R33  value 470  [J1-0603]  (hidden comment: Res3)
R34  value 470  [J1-0603]  (hidden comment: Res3)
R35  value 470  [J1-0603]  (hidden comment: Res3)
R36  value 470  [J1-0603]  (hidden comment: Res3)
R37  value 10K  [J1-0603]  (hidden comment: Res3)
R38  value 10K  [J1-0603]  (hidden comment: Res3)
R39  value 470  [J1-0603]  (hidden comment: Res3)
R40  value 470  [J1-0603]  (hidden comment: Res3)
R41  value 470  [J1-0603]  (hidden comment: Res3)
R42  value 470  [J1-0603]  (hidden comment: Res3)
R43  value 10K  [J1-0603]  (hidden comment: Res3)
R44  value 10K  [J1-0603]  (hidden comment: Res3)
R45  value 10K  [J1-0603]  (hidden comment: Res3)
R46  value 470  [J1-0603]  (hidden comment: Res3)
R47  value 470  [J1-0603]  (hidden comment: Res3)
R48  value 470  [J1-0603]  (hidden comment: Res3)
R49  value 470  [J1-0603]  (hidden comment: Res3)
R50  value 10K  [J1-0603]  (hidden comment: Res3)
R51  value 470  [J1-0603]  (hidden comment: Res3)
R52  value 470  [J1-0603]  (hidden comment: Res3)
R53  value 470  [J1-0603]  (hidden comment: Res3)
R54  value 470  [J1-0603]  (hidden comment: Res3)
R55  value 10K  [J1-0603]  (hidden comment: Res3)
SW1  FSM6JSMA  [SW_6x6]  (value not drawn)
SW2  FSM6JSMA  [SW_6x6]  (value not drawn)
SW3  FSM6JSMA  [SW_6x6]  (value not drawn)
SW4  FSM6JSMA  [SW_6x6]  (value not drawn)

### Ports
LBTN_0 (out), LBTN_1 (out), LBTN_2 (out), LBTN_3 (out), LED_COL_0 (in), LED_COL_1 (in), LED_COL_2 (in), LED_COL_3 (in), LED_ROW_0 (in), LED_ROW_1 (in), LED_ROW_2 (in), LED_ROW_3 (in)

### Nets
3V3A: C52.2 Q1.2(S) Q2.2(S) Q3.2(S) Q4.2(S) R32.1 R37.1 R38.1 R43.1 R44.1 R45.1 R50.1 R55.1
GND: C52.1 Q5.2(S) Q6.2(S) Q7.2(S) Q8.2(S) SW1.1 SW1.2 SW2.1 SW2.2 SW3.1 SW3.2 SW4.1 SW4.2
BUTTON_0: R32.2 SW1.3 SW1.4 ; port LBTN_0
BUTTON_1: R38.2 SW2.3 SW2.4 ; port LBTN_1
BUTTON_2: R44.2 SW3.3 SW3.4 ; port LBTN_2
BUTTON_3: R45.2 SW4.3 SW4.4 ; port LBTN_3
LED_COL_0: Q5.1(G) ; port LED_COL_0
LED_COL_1: Q6.1(G) ; port LED_COL_1
LED_COL_2: Q7.1(G) ; port LED_COL_2
LED_COL_3: Q8.1(G) ; port LED_COL_3
LED_ROW_0: Q1.1(G) R37.2 ; port LED_ROW_0
LED_ROW_1: Q2.1(G) R43.2 ; port LED_ROW_1
LED_ROW_2: Q3.1(G) R50.2 ; port LED_ROW_2
LED_ROW_3: Q4.1(G) R55.2 ; port LED_ROW_3
NetD3_1: D3.1 D7.1 D11.1 D15.1 Q5.3(D)
NetD3_2: D3.2 R33.2
NetD4_1: D4.1 D8.1 D12.1 D16.1 Q6.3(D)
NetD4_2: D4.2 R34.2
NetD5_1: D5.1 D9.1 D13.1 D17.1 Q7.3(D)
NetD5_2: D5.2 R35.2
NetD6_1: D6.1 D10.1 D14.1 D18.1 Q8.3(D)
NetD6_2: D6.2 R36.2
NetD7_2: D7.2 R39.2
NetD8_2: D8.2 R40.2
NetD9_2: D9.2 R41.2
NetD10_2: D10.2 R42.2
NetD11_2: D11.2 R46.2
NetD12_2: D12.2 R47.2
NetD13_2: D13.2 R48.2
NetD14_2: D14.2 R49.2
NetD15_2: D15.2 R51.2
NetD16_2: D16.2 R52.2
NetD17_2: D17.2 R53.2
NetD18_2: D18.2 R54.2
NetQ1_3: Q1.3(D) R33.1 R34.1 R35.1 R36.1
NetQ2_3: Q2.3(D) R39.1 R40.1 R41.1 R42.1
NetQ3_3: Q3.3(D) R46.1 R47.1 R48.1 R49.1
NetQ4_3: Q4.3(D) R51.1 R52.1 R53.1 R54.1

### Library data of the parts
C52 = Cap Semi: Capacitor (Semiconductor SIM Model); Published: 8-Jun-2000; LatestRevisionDate: 29-May-2009; LatestRevisionNote: IPC-7351 Footprint Added.; PackageReference: C1206; Publisher: Altium Limited; PackageDescription: Chip Capacitor
D3-D18 = LED
Q1-Q4 = BSS84: MOSFET, P-Channel, Logic Level, 50V, 130mA, SOT23
Q5-Q8 = BSS138: MOSFET, N-Channel, Logic Level, 50V, 220mA, SOT23
R32-R55 = Res3: Resistor; Published: 8-Jun-2000; LatestRevisionDate: 29-May-2009; LatestRevisionNote: IPC-7351 Footprint Added.; PackageReference: J1-0603; Publisher: Altium Limited; PackageDescription: Chip Resistor
SW1-SW4 = FSM6JSMA: Switch Push Button N.O. SPST Round Button 0.05A 12VDC 1VA Alternate Contact Gull Wing SMD T/R

## Sheet XMOS_TSBOARD_DAC.SchDoc
size A4; DocumentNumber: 7; SheetNumber: 7; SheetTotal: 8
Used 2 times, as channels U_XMOS_TSBOARD_Xmos/DACR, U_XMOS_TSBOARD_Xmos/DACL. Parts and nets are listed once, with the designators drawn on the sheet.
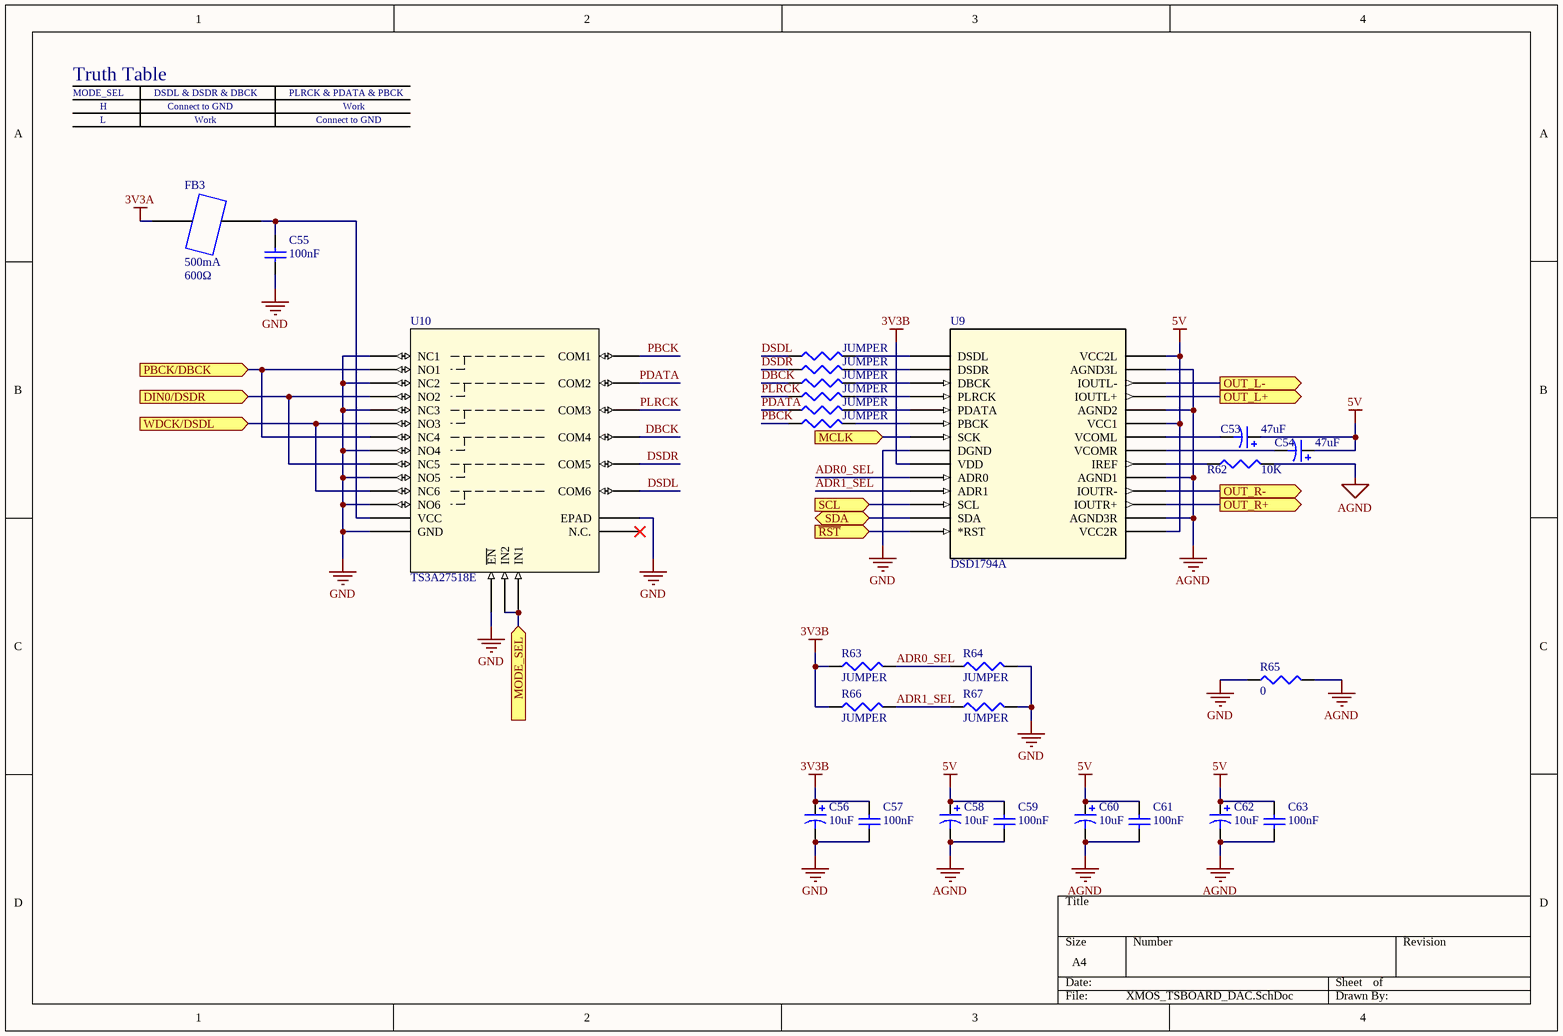
[diagram p4: XMOS_TSBOARD_DAC.SchDoc]

### Parts
C53  value 47uF  [C0805]  (hidden comment: Cap Pol3)
C54  value 47uF  [C0805]  (hidden comment: Cap Pol3)
C55  value 100nF  [1608[0603]]  (hidden comment: Cap Semi)
C56  value 10uF  [C0805]  (hidden comment: Cap Pol3)
C57  value 100nF  [1608[0603]]  (hidden comment: Cap Semi)
C58  value 10uF  [C0805]  (hidden comment: Cap Pol3)
C59  value 100nF  [1608[0603]]  (hidden comment: Cap Semi)
C60  value 10uF  [C0805]  (hidden comment: Cap Pol3)
C61  value 100nF  [1608[0603]]  (hidden comment: Cap Semi)
C62  value 10uF  [C0805]  (hidden comment: Cap Pol3)
C63  value 100nF  [1608[0603]]  (hidden comment: Cap Semi)
FB3  RatedCurrent: 500mA  Impedance(100MHz): 600Ω  [0603]  (hidden comment: FerriteBeads)
R56  JUMPER  [J1-0603]
R57  JUMPER  [J1-0603]
R58  JUMPER  [J1-0603]
R59  JUMPER  [J1-0603]
R60  JUMPER  [J1-0603]
R61  JUMPER  [J1-0603]
R62  value 10K  [J1-0603]  (hidden comment: Res3)
R63  JUMPER  [J1-0603]
R64  JUMPER  [J1-0603]
R65  value 0  [J1-0603]  (hidden comment: Res3)
R66  JUMPER  [J1-0603]
R67  JUMPER  [J1-0603]
U9  DSD1794A  [DB28]
U10  TS3A27518E  [RTW24]

### Ports
DIN0/DSDR (in), MCLK (in), MODE_SEL (in), OUT_L+ (out), OUT_L- (out), OUT_R+ (out), OUT_R- (out), PBCK/DBCK (in), SCL (in), SDA (bidir), WDCK/DSDL (in), ~{RST} (in)

### Nets
3V3A: FB3.1
3V3B: C56.1 C57.2 R63.1 R66.1 U9.9(VDD)
5V: C53.1 C54.1 C58.1 C59.2 C60.1 C61.2 C62.1 C63.2 U9.15(VCC2R) U9.23(VCC1) U9.28(VCC2L)
AGND: C58.2 C59.1 C60.2 C61.1 C62.2 C63.1 R62.2 R65.2 U9.16(AGND3R) U9.19(AGND1) U9.24(AGND2) U9.27(AGND3L)
GND: C55.1 C56.2 C57.1 R64.2 R65.1 R67.2 U9.8(DGND) U10.2(GND) U10.13(NO6) U10.14(NO4) U10.15(NO5) U10.17(~{EN}) U10.20(NC3) U10.22(NC2) U10.23(NC1) U10.25(EPAD)
ADR0_SEL: R63.2 R64.1 U9.10(ADR0)
ADR1_SEL: R66.2 R67.1 U9.11(ADR1)
DBCK: R58.1 U10.6(COM4)
DIN0/DSDR: U10.10(NO2) U10.16(NC5) ; port DIN0/DSDR
DSDL: R56.1 U10.9(COM6)
DSDR: R57.1 U10.7(COM5)
MCLK: U9.7(SCK) ; port MCLK
MODE_SEL: U10.11(IN2) U10.21(IN1) ; port MODE_SEL
OUT_L+: U9.25(IOUTL+) ; port OUT_L+
OUT_L-: U9.26(IOUTL-) ; port OUT_L-
OUT_R+: U9.17(IOUTR+) ; port OUT_R+
OUT_R-: U9.18(IOUTR-) ; port OUT_R-
PBCK: R61.1 U10.1(COM1)
PBCK/DBCK: U10.8(NO1) U10.18(NC4) ; port PBCK/DBCK
PDATA: R60.1 U10.3(COM2)
PLRCK: R59.1 U10.4(COM3)
~{RST}: U9.14(*RST) ; port ~{RST}
SCL: U9.12(SCL) ; port SCL
SDA: U9.13(SDA) ; port SDA
WDCK/DSDL: U10.12(NO3) U10.19(NC6) ; port WDCK/DSDL
NetC53_2: C53.2 U9.22(VCOML)
NetC54_2: C54.2 U9.21(VCOMR)
NetC55_2: C55.2 FB3.2 U10.5(VCC)
NetR56_2: R56.2 U9.1(DSDL)
NetR57_2: R57.2 U9.2(DSDR)
NetR58_2: R58.2 U9.3(DBCK)
NetR59_2: R59.2 U9.4(PLRCK)
NetR60_2: R60.2 U9.5(PDATA)
NetR61_2: R61.2 U9.6(PBCK)
NetR62_1: R62.1 U9.20(IREF)

Not connected (* = marked no-connect by the designer): U10 24(N.C.)*

### Channels
U_XMOS_TSBOARD_Xmos/DACR: designators end in _DACR; ports DIN0/DSDR=DAC_DATA MCLK=DACR_MCLK MODE_SEL=DSD_MODE OUT_L+=IN0_P OUT_L-=IN0_N OUT_R+=IN1_P OUT_R-=IN1_N PBCK/DBCK=DAC_BCK SCL=SCL SDA=SDA WDCK/DSDL=DAC_WDCK ~{RST}=DAC_RST
U_XMOS_TSBOARD_Xmos/DACL: designators end in _DACL; ports DIN0/DSDR=DAC_DATA MCLK=DACL_MCLK MODE_SEL=DSD_MODE OUT_L+=IN0_P OUT_L-=IN0_N OUT_R+=IN1_P OUT_R-=IN1_N PBCK/DBCK=DAC_BCK SCL=SCL SDA=SDA WDCK/DSDL=DAC_WDCK ~{RST}=DAC_RST

### Notes on the sheet
- Truth Table
- MODE_SEL
- H
- DSDL & DSDR & DBCK
- Connect to GND
- PLRCK & PDATA & PBCK
- Work
- L

### Library data of the parts
C53 C54 C56 C58 C60 C62 = Cap Pol3: Polarized Capacitor (Surface Mount); Published: 8-Jun-2000; LatestRevisionDate: 29-May-2009; LatestRevisionNote: IPC-7351 Footprint Added.; PackageReference: C0805; Publisher: Altium Limited; PackageDescription: Chip Capacitor
C55 C57 C59 C61 C63 = Cap Semi: Capacitor (Semiconductor SIM Model); Published: 8-Jun-2000; LatestRevisionDate: 29-May-2009; LatestRevisionNote: IPC-7351 Footprint Added.; PackageReference: C1206; Publisher: Altium Limited; PackageDescription: Chip Capacitor
FB3 = FerriteBeads: Chip Ferrite Beads; DCResistance: 0.35Ω; ManID: BLM18EG601
R56-R61 R63 R64 R66 R67 = Res3: Resistor; Value: 0; Published: 8-Jun-2000; LatestRevisionDate: 29-May-2009; LatestRevisionNote: IPC-7351 Footprint Added.; PackageReference: J1-0603; Publisher: Altium Limited; PackageDescription: Chip Resistor
R62 R65 = Res3: Resistor; Published: 8-Jun-2000; LatestRevisionDate: 29-May-2009; LatestRevisionNote: IPC-7351 Footprint Added.; PackageReference: J1-0603; Publisher: Altium Limited; PackageDescription: Chip Resistor
U9 = DSD1794A: 24-Bit 192-kHz Sampling Advanced Segment Audio Stereo DAC
U10 = TS3A27518E: 6-Channel, 1:2 Multiplexer/Demultiplexer

## Sheet XMOS_TSBOARD_IV.SchDoc
size A4; DocumentNumber: 8; SheetNumber: 8; SheetTotal: 8
Used 2 times, as channels U_XMOS_TSBOARD_Xmos/LPFR, U_XMOS_TSBOARD_Xmos/LPFL. Parts and nets are listed once, with the designators drawn on the sheet.
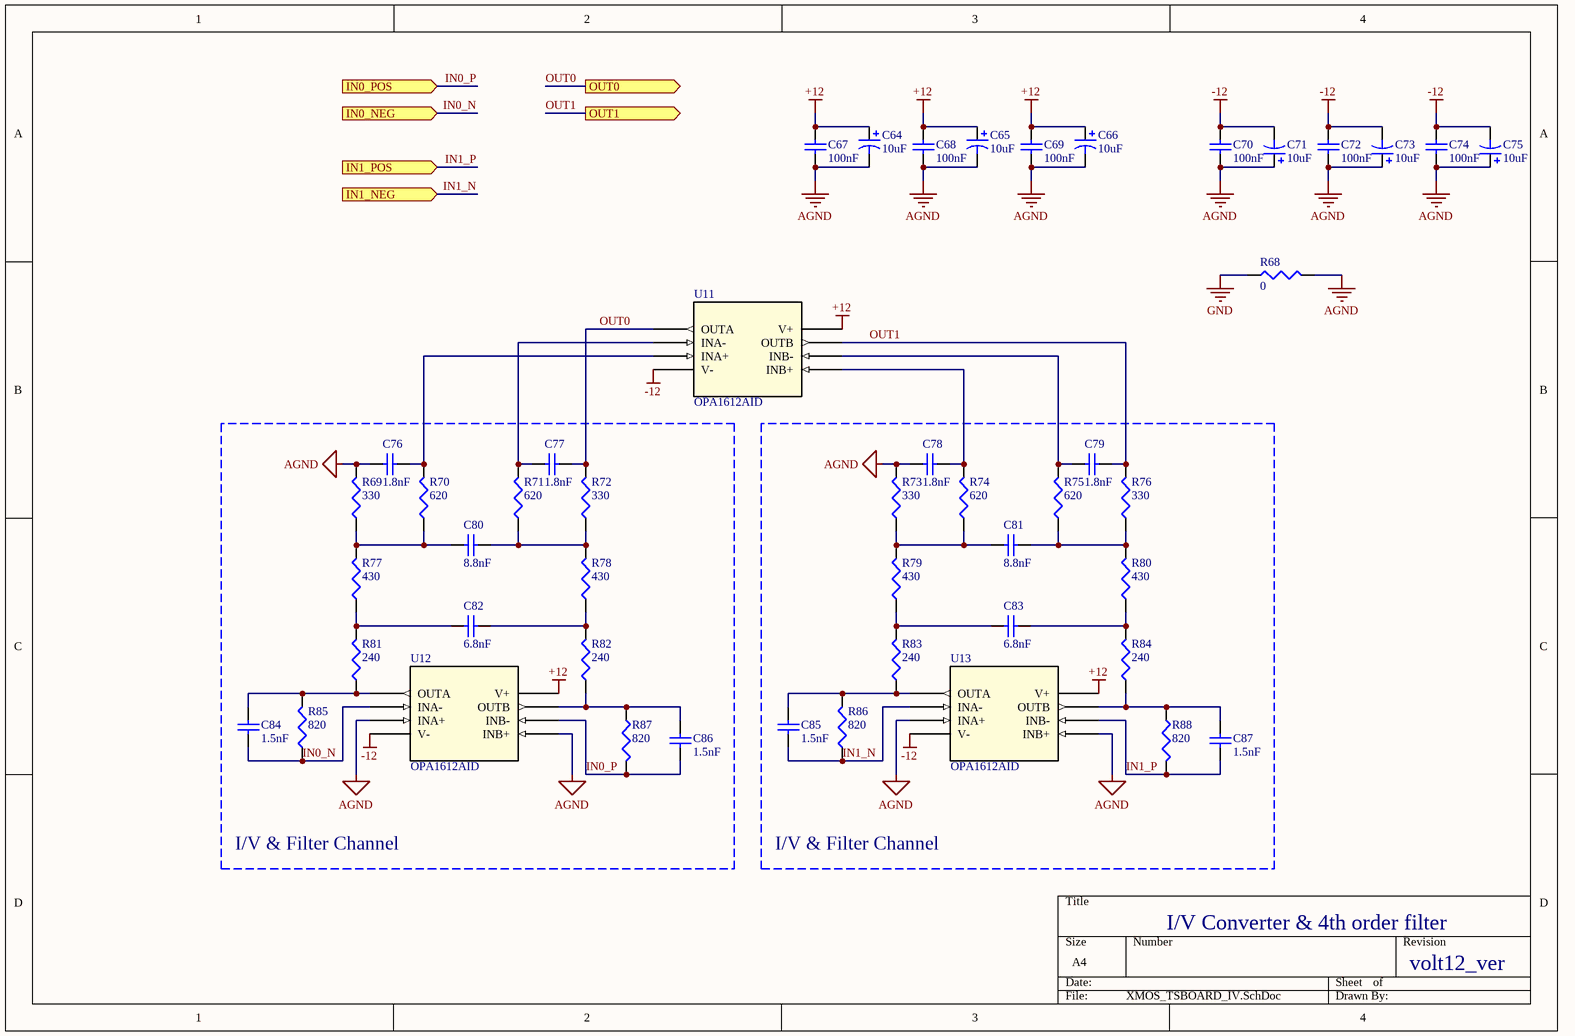
[diagram p5: XMOS_TSBOARD_IV.SchDoc]

### Parts
C64  value 10uF  [C0805]  (hidden comment: Cap Pol3)
C65  value 10uF  [C0805]  (hidden comment: Cap Pol3)
C66  value 10uF  [C0805]  (hidden comment: Cap Pol3)
C67  value 100nF  [1608[0603]]  (hidden comment: Cap Semi)
C68  value 100nF  [1608[0603]]  (hidden comment: Cap Semi)
C69  value 100nF  [1608[0603]]  (hidden comment: Cap Semi)
C70  value 100nF  [1608[0603]]  (hidden comment: Cap Semi)
C71  value 10uF  [C0805]  (hidden comment: Cap Pol3)
C72  value 100nF  [1608[0603]]  (hidden comment: Cap Semi)
C73  value 10uF  [C0805]  (hidden comment: Cap Pol3)
C74  value 100nF  [1608[0603]]  (hidden comment: Cap Semi)
C75  value 10uF  [C0805]  (hidden comment: Cap Pol3)
C76  value 1.8nF  [1608[0603]]  (hidden comment: Cap Semi)
C77  value 1.8nF  [1608[0603]]  (hidden comment: Cap Semi)
C78  value 1.8nF  [1608[0603]]  (hidden comment: Cap Semi)
C79  value 1.8nF  [1608[0603]]  (hidden comment: Cap Semi)
C80  value 8.8nF  [1608[0603]]  (hidden comment: Cap Semi)
C81  value 8.8nF  [1608[0603]]  (hidden comment: Cap Semi)
C82  value 6.8nF  [1608[0603]]  (hidden comment: Cap Semi)
C83  value 6.8nF  [1608[0603]]  (hidden comment: Cap Semi)
C84  value 1.5nF  [1608[0603]]  (hidden comment: Cap Semi)
C85  value 1.5nF  [1608[0603]]  (hidden comment: Cap Semi)
C86  value 1.5nF  [1608[0603]]  (hidden comment: Cap Semi)
C87  value 1.5nF  [1608[0603]]  (hidden comment: Cap Semi)
R68  value 0  [J1-0603]  (hidden comment: Res3)
R69  value 330  [J1-0603]  (hidden comment: Res3)
R70  value 620  [J1-0603]  (hidden comment: Res3)
R71  value 620  [J1-0603]  (hidden comment: Res3)
R72  value 330  [J1-0603]  (hidden comment: Res3)
R73  value 330  [J1-0603]  (hidden comment: Res3)
R74  value 620  [J1-0603]  (hidden comment: Res3)
R75  value 620  [J1-0603]  (hidden comment: Res3)
R76  value 330  [J1-0603]  (hidden comment: Res3)
R77  value 430  [J1-0603]  (hidden comment: Res3)
R78  value 430  [J1-0603]  (hidden comment: Res3)
R79  value 430  [J1-0603]  (hidden comment: Res3)
R80  value 430  [J1-0603]  (hidden comment: Res3)
R81  value 240  [J1-0603]  (hidden comment: Res3)
R82  value 240  [J1-0603]  (hidden comment: Res3)
R83  value 240  [J1-0603]  (hidden comment: Res3)
R84  value 240  [J1-0603]  (hidden comment: Res3)
R85  value 820  [J1-0603]  (hidden comment: Res3)
R86  value 820  [J1-0603]  (hidden comment: Res3)
R87  value 820  [J1-0603]  (hidden comment: Res3)
R88  value 820  [J1-0603]  (hidden comment: Res3)
U11  OPA1612AID  [D8]
U12  OPA1612AID  [D8]
U13  OPA1612AID  [D8]

### Blocks framed on the sheet
I/V & Filter Channel: C76 C77 C80 C82 C84 C86 R69-R72 R77 R78 R81 R82 R85 R87 U12
I/V & Filter Channel: C78 C79 C81 C83 C85 C87 R73-R76 R79 R80 R83 R84 R86 R88 U13

### Ports
IN0_NEG (in), IN0_POS (in), IN1_NEG (in), IN1_POS (in), OUT0 (out), OUT1 (out)

### Nets
+12: C64.1 C65.1 C66.1 C67.2 C68.2 C69.2 U11.8(V+) U12.8(V+) U13.8(V+)
-12: C70.2 C71.2 C72.2 C73.2 C74.2 C75.2 U11.4(V-) U12.4(V-) U13.4(V-)
AGND: C64.2 C65.2 C66.2 C67.1 C68.1 C69.1 C70.1 C71.1 C72.1 C73.1 C74.1 C75.1 C76.2 C78.2 R68.2 R69.2 R73.2 U12.3(INA+) U12.5(INB+) U13.3(INA+) U13.5(INB+)
GND: R68.1
IN0_N: C84.1 R85.1 U12.2(INA-) ; port IN0_NEG
IN0_P: C86.2 R87.2 U12.6(INB-) ; port IN0_POS
IN1_N: C85.1 R86.1 U13.2(INA-) ; port IN1_NEG
IN1_P: C87.2 R88.2 U13.6(INB-) ; port IN1_POS
OUT0: C77.1 R72.2 U11.1(OUTA) ; port OUT0
OUT1: C79.1 R76.2 U11.7(OUTB) ; port OUT1
NetC76_1: C76.1 R70.2 U11.3(INA+)
NetC77_2: C77.2 R71.2 U11.2(INA-)
NetC78_1: C78.1 R74.2 U11.5(INB+)
NetC79_2: C79.2 R75.2 U11.6(INB-)
NetC80_1: C80.1 R71.1 R72.1 R78.2
NetC80_2: C80.2 R69.1 R70.1 R77.2
NetC81_1: C81.1 R75.1 R76.1 R80.2
NetC81_2: C81.2 R73.1 R74.1 R79.2
NetC82_1: C82.1 R78.1 R82.2
NetC82_2: C82.2 R77.1 R81.2
NetC83_1: C83.1 R80.1 R84.2
NetC83_2: C83.2 R79.1 R83.2
NetC84_2: C84.2 R81.1 R85.2 U12.1(OUTA)
NetC85_2: C85.2 R83.1 R86.2 U13.1(OUTA)
NetC86_1: C86.1 R82.1 R87.1 U12.7(OUTB)
NetC87_1: C87.1 R84.1 R88.1 U13.7(OUTB)

### Channels
U_XMOS_TSBOARD_Xmos/LPFR: designators end in _LPFR; ports IN0_NEG=IN0_N IN0_POS=IN0_P IN1_NEG=IN1_N IN1_POS=IN1_P OUT0=OUT0 OUT1=OUT1
U_XMOS_TSBOARD_Xmos/LPFL: designators end in _LPFL; ports IN0_NEG=IN0_N IN0_POS=IN0_P IN1_NEG=IN1_N IN1_POS=IN1_P OUT0=L_XLR_HOT OUT1=L_XLR_COLD

### Notes on the sheet
- I/V Converter & 4th order filter
- volt12_ver

### Library data of the parts
C64-C66 C71 C73 C75 = Cap Pol3: Polarized Capacitor (Surface Mount); Published: 8-Jun-2000; LatestRevisionDate: 29-May-2009; LatestRevisionNote: IPC-7351 Footprint Added.; PackageReference: C0805; Publisher: Altium Limited; PackageDescription: Chip Capacitor
C67-C70 C72 C74 C76-C87 = Cap Semi: Capacitor (Semiconductor SIM Model); Published: 8-Jun-2000; LatestRevisionDate: 29-May-2009; LatestRevisionNote: IPC-7351 Footprint Added.; PackageReference: C1206; Publisher: Altium Limited; PackageDescription: Chip Capacitor
R68-R88 = Res3: Resistor; Published: 8-Jun-2000; LatestRevisionDate: 29-May-2009; LatestRevisionNote: IPC-7351 Footprint Added.; PackageReference: J1-0603; Publisher: Altium Limited; PackageDescription: Chip Resistor
U11-U13 = OPA1612AID: SoundPlus High-Performance, Bipolar-Input Audio Operational Amplifiers

## Sheet XMOS_TSBOARD_SPDIF.SchDoc
size A4; DocumentNumber: 6; SheetNumber: 6; SheetTotal: 8
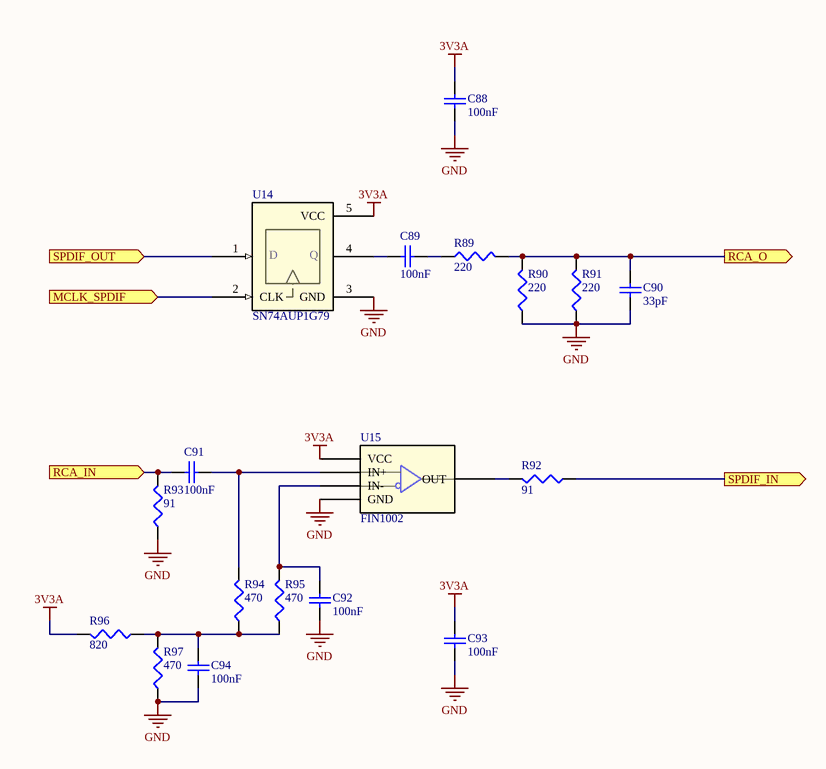
[diagram p6: XMOS_TSBOARD_SPDIF.SchDoc]

### Parts
C88  value 100nF  [1608[0603]]  (hidden comment: Cap Semi)
C89  value 100nF  [1608[0603]]  (hidden comment: Cap Semi)
C90  value 33pF  [1608[0603]]  (hidden comment: Cap Semi)
C91  value 100nF  [1608[0603]]  (hidden comment: Cap Semi)
C92  value 100nF  [1608[0603]]  (hidden comment: Cap Semi)
C93  value 100nF  [1608[0603]]  (hidden comment: Cap Semi)
C94  value 100nF  [1608[0603]]  (hidden comment: Cap Semi)
R89  value 220  [J1-0603]  (hidden comment: Res3)
R90  value 220  [J1-0603]  (hidden comment: Res3)
R91  value 220  [J1-0603]  (hidden comment: Res3)
R92  value 91  [J1-0603]  (hidden comment: Res3)
R93  value 91  [J1-0603]  (hidden comment: Res3)
R94  value 470  [J1-0603]  (hidden comment: Res3)
R95  value 470  [J1-0603]  (hidden comment: Res3)
R96  value 820  [J1-0603]  (hidden comment: Res3)
R97  value 470  [J1-0603]  (hidden comment: Res3)
U14  SN74AUP1G79  [DBV5]
U15  FIN1002  [DBV5]

### Ports
MCLK_SPDIF (in), RCA_IN (in), RCA_O (out), SPDIF_IN (out), SPDIF_OUT (in)

### Nets
3V3A: C88.2 C93.2 R96.2 U14.5(VCC) U15.1(VCC)
GND: C88.1 C90.1 C92.1 C93.1 C94.1 R90.1 R91.1 R93.1 R97.1 U14.3(GND) U15.2(GND)
CN_RCA_IN: C91.1 R93.2 ; port RCA_IN
CN_RCA_OUT: C90.2 R89.2 R90.2 R91.2 ; port RCA_O
SPDIF_IN: R92.1 ; port SPDIF_IN
SPDIF_MCLK: U14.2(CLK) ; port MCLK_SPDIF
SPDIF_OUT: U14.1(D) ; port SPDIF_OUT
NetC89_1: C89.1 U14.4(Q)
NetC89_2: C89.2 R89.1
NetC91_2: C91.2 R94.2 U15.3(IN+)
NetC92_2: C92.2 R95.2 U15.4(IN-)
NetC94_2: C94.2 R94.1 R95.1 R96.1 R97.2
NetR92_2: R92.2 U15.5(OUT)

### Library data of the parts
C88-C94 = Cap Semi: Capacitor (Semiconductor SIM Model); Published: 8-Jun-2000; LatestRevisionDate: 29-May-2009; LatestRevisionNote: IPC-7351 Footprint Added.; PackageReference: C1206; Publisher: Altium Limited; PackageDescription: Chip Capacitor
R89-R97 = Res3: Resistor; Published: 8-Jun-2000; LatestRevisionDate: 29-May-2009; LatestRevisionNote: IPC-7351 Footprint Added.; PackageReference: J1-0603; Publisher: Altium Limited; PackageDescription: Chip Resistor
U14 = SN74AUP1G79: Low-Power Single Positive-Edge-Triggered D-Type Flip-Flop
U15 = FIN1002: LVDS 1-Bit High Speed Differential Receiver

## Sheet XMOS_TSBOARD_Clock.SchDoc
size A4; DocumentNumber: 4; SheetNumber: 4; SheetTotal: 8
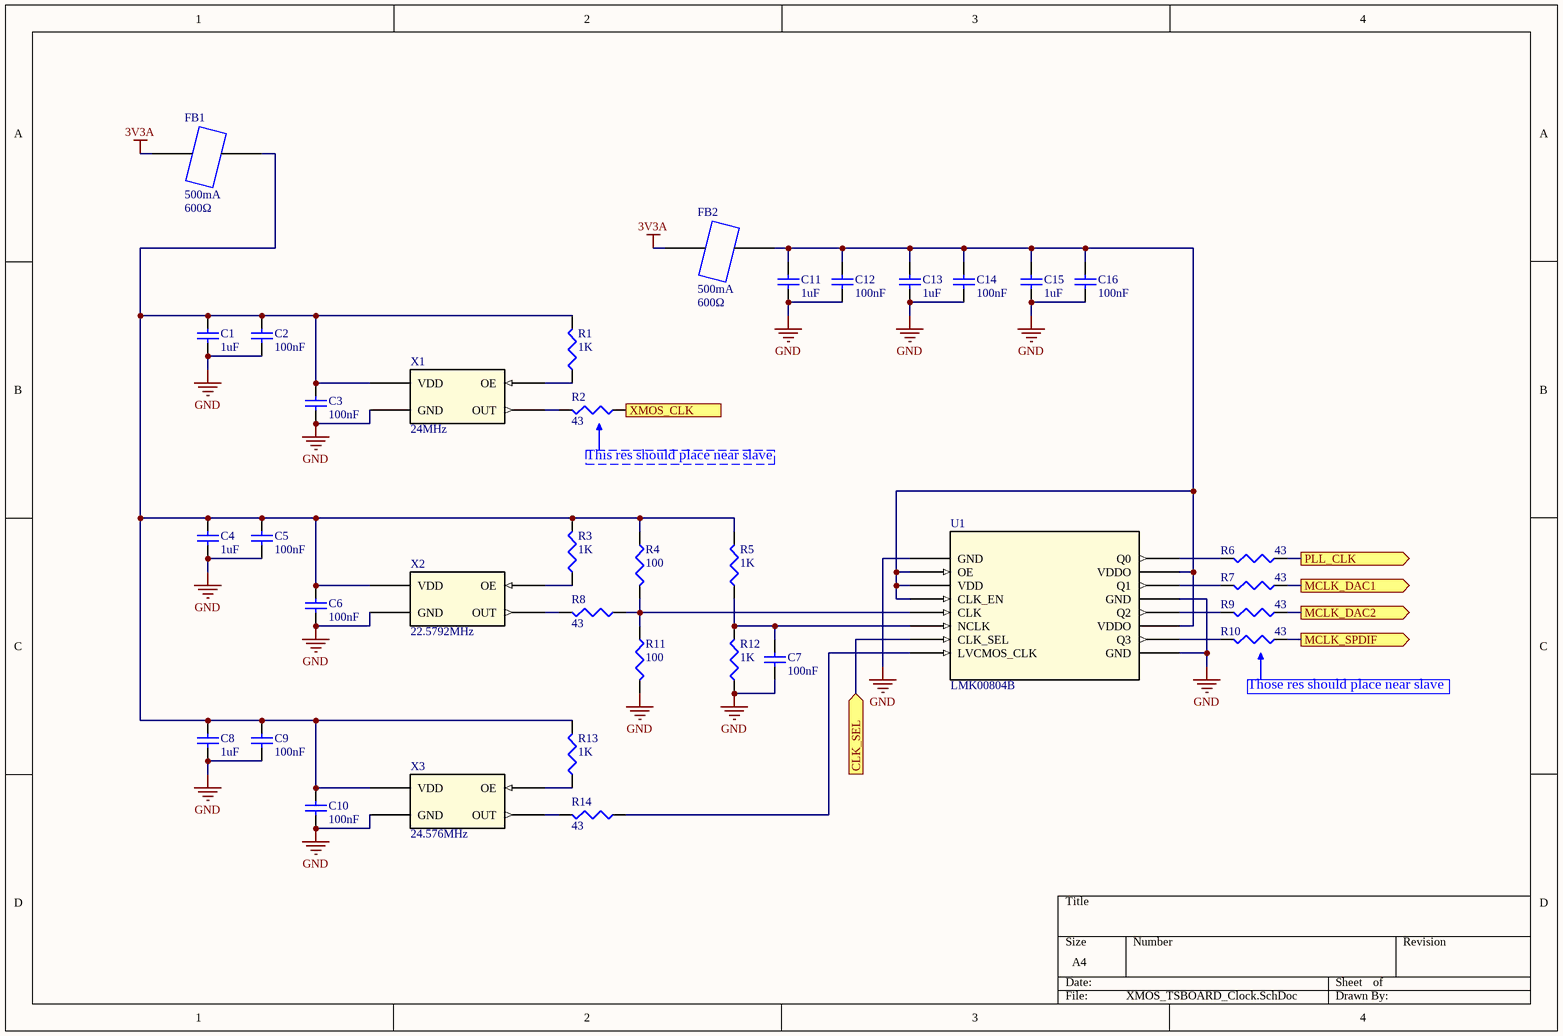
[diagram p7: XMOS_TSBOARD_Clock.SchDoc]

### Parts
C1  value 1uF  [1608[0603]]  (hidden comment: Cap Semi)
C2  value 100nF  [1608[0603]]  (hidden comment: Cap Semi)
C3  value 100nF  [1608[0603]]  (hidden comment: Cap Semi)
C4  value 1uF  [1608[0603]]  (hidden comment: Cap Semi)
C5  value 100nF  [1608[0603]]  (hidden comment: Cap Semi)
C6  value 100nF  [1608[0603]]  (hidden comment: Cap Semi)
C7  value 100nF  [1608[0603]]  (hidden comment: Cap Semi)
C8  value 1uF  [1608[0603]]  (hidden comment: Cap Semi)
C9  value 100nF  [1608[0603]]  (hidden comment: Cap Semi)
C10  value 100nF  [1608[0603]]  (hidden comment: Cap Semi)
C11  value 1uF  [1608[0603]]  (hidden comment: Cap Semi)
C12  value 100nF  [1608[0603]]  (hidden comment: Cap Semi)
C13  value 1uF  [1608[0603]]  (hidden comment: Cap Semi)
C14  value 100nF  [1608[0603]]  (hidden comment: Cap Semi)
C15  value 1uF  [1608[0603]]  (hidden comment: Cap Semi)
C16  value 100nF  [1608[0603]]  (hidden comment: Cap Semi)
FB1  RatedCurrent: 500mA  Impedance(100MHz): 600Ω  [0603]  (hidden comment: FerriteBeads)
FB2  RatedCurrent: 500mA  Impedance(100MHz): 600Ω  [0603]  (hidden comment: FerriteBeads)
R1  value 1K  [J1-0603]  (hidden comment: Res3)
R2  value 43  [J1-0603]  (hidden comment: Res3)
R3  value 1K  [J1-0603]  (hidden comment: Res3)
R4  value 100  [J1-0603]  (hidden comment: Res3)
R5  value 1K  [J1-0603]  (hidden comment: Res3)
R6  value 43  [J1-0603]  (hidden comment: Res3)
R7  value 43  [J1-0603]  (hidden comment: Res3)
R8  value 43  [J1-0603]  (hidden comment: Res3)
R9  value 43  [J1-0603]  (hidden comment: Res3)
R10  value 43  [J1-0603]  (hidden comment: Res3)
R11  value 100  [J1-0603]  (hidden comment: Res3)
R12  value 1K  [J1-0603]  (hidden comment: Res3)
R13  value 1K  [J1-0603]  (hidden comment: Res3)
R14  value 43  [J1-0603]  (hidden comment: Res3)
U1  LMK00804B  [PW16]
X1  Frequency: 24MHz  [7050]  (hidden comment: SiT8208)
X2  Frequency: 22.5792MHz  [7050]  (hidden comment: SiT8208)
X3  Frequency: 24.576MHz  [7050]  (hidden comment: SiT8208)

### Ports
CLK_SEL (in), MCLK_DAC1 (out), MCLK_DAC2 (out), MCLK_SPDIF (out), PLL_CLK (out), XMOS_CLK (out)

### Nets
3V3A: FB1.1 FB2.1
GND: C1.1 C2.1 C3.1 C4.1 C5.1 C6.1 C7.1 C8.1 C9.1 C10.1 C11.1 C12.1 C13.1 C14.1 C15.1 C16.1 R11.2 R12.1 U1.1(GND) U1.9(GND) U1.13(GND) X1.2(GND) X2.2(GND) X3.2(GND)
CLK_SEL: U1.7(CLK_SEL) ; port CLK_SEL
DACL_MCLK: R9.1 ; port MCLK_DAC2
DACR_MCLK: R7.1 ; port MCLK_DAC1
PLL_CLK: R6.1 ; port PLL_CLK
SPDIF_MCLK: R10.1 ; port MCLK_SPDIF
XMOS_CLK: R2.1 ; port XMOS_CLK
NetC1_2: C1.2 C2.2 C3.2 C4.2 C5.2 C6.2 C8.2 C9.2 C10.2 FB1.2 R1.2 R3.2 R4.1 R5.2 R13.2 X1.4(VDD) X2.4(VDD) X3.4(VDD)
NetC7_2: C7.2 R5.1 R12.2 U1.6(NCLK)
NetC11_2: C11.2 C12.2 C13.2 C14.2 C15.2 C16.2 FB2.2 U1.2(OE) U1.3(VDD) U1.4(CLK_EN) U1.11(VDDO) U1.15(VDDO)
NetR1_1: R1.1 X1.1(OE)
NetR2_2: R2.2 X1.3(OUT)
NetR3_1: R3.1 X2.1(OE)
NetR4_2: R4.2 R8.1 R11.1 U1.5(CLK)
NetR6_2: R6.2 U1.16(Q0)
NetR7_2: R7.2 U1.14(Q1)
NetR8_2: R8.2 X2.3(OUT)
NetR9_2: R9.2 U1.12(Q2)
NetR10_2: R10.2 U1.10(Q3)
NetR13_1: R13.1 X3.1(OE)
NetR14_1: R14.1 U1.8(LVCMOS_CLK)
NetR14_2: R14.2 X3.3(OUT)

### Notes on the sheet
- (near R2) This res should place near slave
- (near R10) Those res should place near slave

### Library data of the parts
C1-C16 = Cap Semi: Capacitor (Semiconductor SIM Model); Published: 8-Jun-2000; LatestRevisionDate: 29-May-2009; LatestRevisionNote: IPC-7351 Footprint Added.; PackageReference: C1206; Publisher: Altium Limited; PackageDescription: Chip Capacitor
FB1 FB2 = FerriteBeads: as FB3 on sheet XMOS_TSBOARD_DAC
R1-R14 = Res3: Resistor; Published: 8-Jun-2000; LatestRevisionDate: 29-May-2009; LatestRevisionNote: IPC-7351 Footprint Added.; PackageReference: J1-0603; Publisher: Altium Limited; PackageDescription: Chip Resistor
U1 = LMK00804B: Low Skew, 1-to-4 Multiplexed Differential/LVCMOS-to-LVCMOS/TTL Fanout Buffer
X1-X3 = SiT8208: Ultra Performance Oscillator

## Nets that join several sheets
1V0: XMOS_TSBOARD_Power (C34.2 R22.2 U5.14 U5.15), XMOS_TSBOARD_Xmos (18 pins)
3V3A: XMOS_TSBOARD_Power (C37.2 R24.2 U5.11 U5.12), XMOS_TSBOARD_Xmos (16 pins), XMOS_TSBOARD_PHY (13 pins), U_XMOS_TSBOARD_Xmos/DACR (FB3_DACR.1), U_XMOS_TSBOARD_Xmos/DACL (FB3_DACL.1), XMOS_TSBOARD_SPDIF (5 pins), XMOS_TSBOARD_Clock (FB1.1 FB2.1)
3V3B: XMOS_TSBOARD_Power (C43.2 R26.2 U7.14 U7.15), U_XMOS_TSBOARD_Xmos/DACR (5 pins), U_XMOS_TSBOARD_Xmos/DACL (5 pins)
5V: XMOS_TSBOARD_Power (C48.2 R29.2 U7.11 U7.12), U_XMOS_TSBOARD_Xmos/DACR (11 pins), U_XMOS_TSBOARD_Xmos/DACL (11 pins)
+12: XMOS_TSBOARD_Power (C39.2 U6.1 U6.3 U6.20), U_XMOS_TSBOARD_Xmos/LPFR (9 pins), U_XMOS_TSBOARD_Xmos/LPFL (9 pins)
-12: XMOS_TSBOARD_Power (5 pins), U_XMOS_TSBOARD_Xmos/LPFR (9 pins), U_XMOS_TSBOARD_Xmos/LPFL (9 pins)
AGND: XMOS_TSBOARD_Top (CN1.1 CN1.G CN2.1 CN2.G), U_XMOS_TSBOARD_Xmos/DACR (12 pins), U_XMOS_TSBOARD_Xmos/LPFR (21 pins), U_XMOS_TSBOARD_Xmos/DACL (12 pins), U_XMOS_TSBOARD_Xmos/LPFL (21 pins)
GND: XMOS_TSBOARD_Top (15 pins), XMOS_TSBOARD_Power (74 pins), XMOS_TSBOARD_Xmos (19 pins), XMOS_TSBOARD_PHY (13 pins), U_XMOS_TSBOARD_Xmos/DACR (16 pins), U_XMOS_TSBOARD_Xmos/LPFR (R68_LPFR.1), U_XMOS_TSBOARD_Xmos/DACL (16 pins), U_XMOS_TSBOARD_Xmos/LPFL (R68_LPFL.1), XMOS_TSBOARD_SPDIF (11 pins), XMOS_TSBOARD_Clock (24 pins)
ORI_5V: XMOS_TSBOARD_Top (P5.1), XMOS_TSBOARD_Power (28 pins)
BUTTON_0: XMOS_TSBOARD_Xmos (U16.35), XMOS_TSBOARD_PHY (R32.2 SW1.3 SW1.4)
BUTTON_1: XMOS_TSBOARD_Xmos (U16.36), XMOS_TSBOARD_PHY (R38.2 SW2.3 SW2.4)
BUTTON_2: XMOS_TSBOARD_Xmos (U16.37), XMOS_TSBOARD_PHY (R44.2 SW3.3 SW3.4)
BUTTON_3: XMOS_TSBOARD_Xmos (U16.38), XMOS_TSBOARD_PHY (R45.2 SW4.3 SW4.4)
CLK_SEL: XMOS_TSBOARD_Xmos (U16.29), XMOS_TSBOARD_Clock (U1.7)
CN_RCA_IN: XMOS_TSBOARD_Top (J2.2), XMOS_TSBOARD_SPDIF (C91.1 R93.2)
CN_RCA_OUT: XMOS_TSBOARD_Top (J3.2), XMOS_TSBOARD_SPDIF (C90.2 R89.2 R90.2 R91.2)
DAC_BCK: XMOS_TSBOARD_Xmos (U16.1), U_XMOS_TSBOARD_Xmos/DACR (U10_DACR.8 U10_DACR.18), U_XMOS_TSBOARD_Xmos/DACL (U10_DACL.8 U10_DACL.18)
DAC_DATA: XMOS_TSBOARD_Xmos (U16.4), U_XMOS_TSBOARD_Xmos/DACR (U10_DACR.10 U10_DACR.16), U_XMOS_TSBOARD_Xmos/DACL (U10_DACL.10 U10_DACL.16)
DAC_RST: XMOS_TSBOARD_Xmos (U16.28), U_XMOS_TSBOARD_Xmos/DACR (U9_DACR.14), U_XMOS_TSBOARD_Xmos/DACL (U9_DACL.14)
DAC_WDCK: XMOS_TSBOARD_Xmos (U16.2), U_XMOS_TSBOARD_Xmos/DACR (U10_DACR.12 U10_DACR.19), U_XMOS_TSBOARD_Xmos/DACL (U10_DACL.12 U10_DACL.19)
DACL_MCLK: U_XMOS_TSBOARD_Xmos/DACL (U9_DACL.7), XMOS_TSBOARD_Clock (R9.1)
DACR_MCLK: U_XMOS_TSBOARD_Xmos/DACR (U9_DACR.7), XMOS_TSBOARD_Clock (R7.1)
DC_5V: XMOS_TSBOARD_Top (P4.2), XMOS_TSBOARD_Power (P1.1)
DC_GND: XMOS_TSBOARD_Top (8 pins), XMOS_TSBOARD_Power (C20.2 P3.1 U3.2 U3.11)
DSD_MODE: XMOS_TSBOARD_Xmos (U16.64), U_XMOS_TSBOARD_Xmos/DACR (U10_DACR.11 U10_DACR.21), U_XMOS_TSBOARD_Xmos/DACL (U10_DACL.11 U10_DACL.21)
IN0_N: U_XMOS_TSBOARD_Xmos/DACR (U9_DACR.26), U_XMOS_TSBOARD_Xmos/LPFR (C84_LPFR.1 R85_LPFR.1 U12_LPFR.2)
IN0_N: U_XMOS_TSBOARD_Xmos/DACL (U9_DACL.26), U_XMOS_TSBOARD_Xmos/LPFL (C84_LPFL.1 R85_LPFL.1 U12_LPFL.2)
IN0_P: U_XMOS_TSBOARD_Xmos/DACR (U9_DACR.25), U_XMOS_TSBOARD_Xmos/LPFR (C86_LPFR.2 R87_LPFR.2 U12_LPFR.6)
IN0_P: U_XMOS_TSBOARD_Xmos/DACL (U9_DACL.25), U_XMOS_TSBOARD_Xmos/LPFL (C86_LPFL.2 R87_LPFL.2 U12_LPFL.6)
IN1_N: U_XMOS_TSBOARD_Xmos/DACR (U9_DACR.18), U_XMOS_TSBOARD_Xmos/LPFR (C85_LPFR.1 R86_LPFR.1 U13_LPFR.2)
IN1_N: U_XMOS_TSBOARD_Xmos/DACL (U9_DACL.18), U_XMOS_TSBOARD_Xmos/LPFL (C85_LPFL.1 R86_LPFL.1 U13_LPFL.2)
IN1_P: U_XMOS_TSBOARD_Xmos/DACR (U9_DACR.17), U_XMOS_TSBOARD_Xmos/LPFR (C87_LPFR.2 R88_LPFR.2 U13_LPFR.6)
IN1_P: U_XMOS_TSBOARD_Xmos/DACL (U9_DACL.17), U_XMOS_TSBOARD_Xmos/LPFL (C87_LPFL.2 R88_LPFL.2 U13_LPFL.6)
L_XLR_COLD: XMOS_TSBOARD_Top (CN1.3), U_XMOS_TSBOARD_Xmos/LPFL (C79_LPFL.1 R76_LPFL.2 U11_LPFL.7)
L_XLR_HOT: XMOS_TSBOARD_Top (CN1.2), U_XMOS_TSBOARD_Xmos/LPFL (C77_LPFL.1 R72_LPFL.2 U11_LPFL.1)
LED_COL_0: XMOS_TSBOARD_Xmos (U16.47), XMOS_TSBOARD_PHY (Q5.1)
LED_COL_1: XMOS_TSBOARD_Xmos (U16.49), XMOS_TSBOARD_PHY (Q6.1)
LED_COL_2: XMOS_TSBOARD_Xmos (U16.50), XMOS_TSBOARD_PHY (Q7.1)
LED_COL_3: XMOS_TSBOARD_Xmos (U16.51), XMOS_TSBOARD_PHY (Q8.1)
LED_ROW_0: XMOS_TSBOARD_Xmos (U16.43), XMOS_TSBOARD_PHY (Q1.1 R37.2)
LED_ROW_1: XMOS_TSBOARD_Xmos (U16.45), XMOS_TSBOARD_PHY (Q2.1 R43.2)
LED_ROW_2: XMOS_TSBOARD_Xmos (U16.46), XMOS_TSBOARD_PHY (Q3.1 R50.2)
LED_ROW_3: XMOS_TSBOARD_Xmos (U16.48), XMOS_TSBOARD_PHY (Q4.1 R55.2)
OUT0: XMOS_TSBOARD_Top (CN2.2), U_XMOS_TSBOARD_Xmos/LPFR (C77_LPFR.1 R72_LPFR.2 U11_LPFR.1)
OUT1: XMOS_TSBOARD_Top (CN2.3), U_XMOS_TSBOARD_Xmos/LPFR (C79_LPFR.1 R76_LPFR.2 U11_LPFR.7)
PLL_CLK: XMOS_TSBOARD_Xmos (U16.42), XMOS_TSBOARD_Clock (R6.1)
RST_N: XMOS_TSBOARD_Top (P5.15), XMOS_TSBOARD_Xmos (R106.2 U16.57)
SCL: XMOS_TSBOARD_Xmos (R107.2 U16.30), U_XMOS_TSBOARD_Xmos/DACR (U9_DACR.12), U_XMOS_TSBOARD_Xmos/DACL (U9_DACL.12)
SDA: XMOS_TSBOARD_Xmos (R108.2 U16.32), U_XMOS_TSBOARD_Xmos/DACR (U9_DACR.13), U_XMOS_TSBOARD_Xmos/DACL (U9_DACL.13)
SPDIF_IN: XMOS_TSBOARD_Xmos (U16.14), XMOS_TSBOARD_SPDIF (R92.1)
SPDIF_MCLK: XMOS_TSBOARD_SPDIF (U14.2), XMOS_TSBOARD_Clock (R10.1)
SPDIF_OUT: XMOS_TSBOARD_Xmos (U16.16), XMOS_TSBOARD_SPDIF (U14.1)
TCK: XMOS_TSBOARD_Top (P5.9), XMOS_TSBOARD_Xmos (U16.61)
TDI: XMOS_TSBOARD_Top (P5.5), XMOS_TSBOARD_Xmos (U16.62)
TDO: XMOS_TSBOARD_Top (P5.13), XMOS_TSBOARD_Xmos (U16.63)
TMS: XMOS_TSBOARD_Top (P5.7), XMOS_TSBOARD_Xmos (U16.60)
USB_D_N: XMOS_TSBOARD_Top (J1.A7 J1.B7), XMOS_TSBOARD_Xmos (U16.26)
USB_D_P: XMOS_TSBOARD_Top (J1.A6 J1.B6), XMOS_TSBOARD_Xmos (U16.25)
USB_VBUS: XMOS_TSBOARD_Top (FB4.1), XMOS_TSBOARD_Power (P1.3), XMOS_TSBOARD_Xmos (C96.2 R101.1 R102.1)
XL_DN0: XMOS_TSBOARD_Top (P5.14), XMOS_TSBOARD_Xmos (U16.6)
XL_DN1: XMOS_TSBOARD_Top (P5.18), XMOS_TSBOARD_Xmos (U16.5)
XL_UP0: XMOS_TSBOARD_Top (P5.10), XMOS_TSBOARD_Xmos (R103.2)
XL_UP1: XMOS_TSBOARD_Top (P5.6), XMOS_TSBOARD_Xmos (R104.2)
XMOS_CLK: XMOS_TSBOARD_Xmos (U16.58), XMOS_TSBOARD_Clock (R2.1)